# Altium project DMX Interface DB.PrjPcb (part 3 of 5)

## Sheet LED_low_side_control.SchDoc: LED Low Power
size B; SheetNumber: 6; SheetTotal: 14
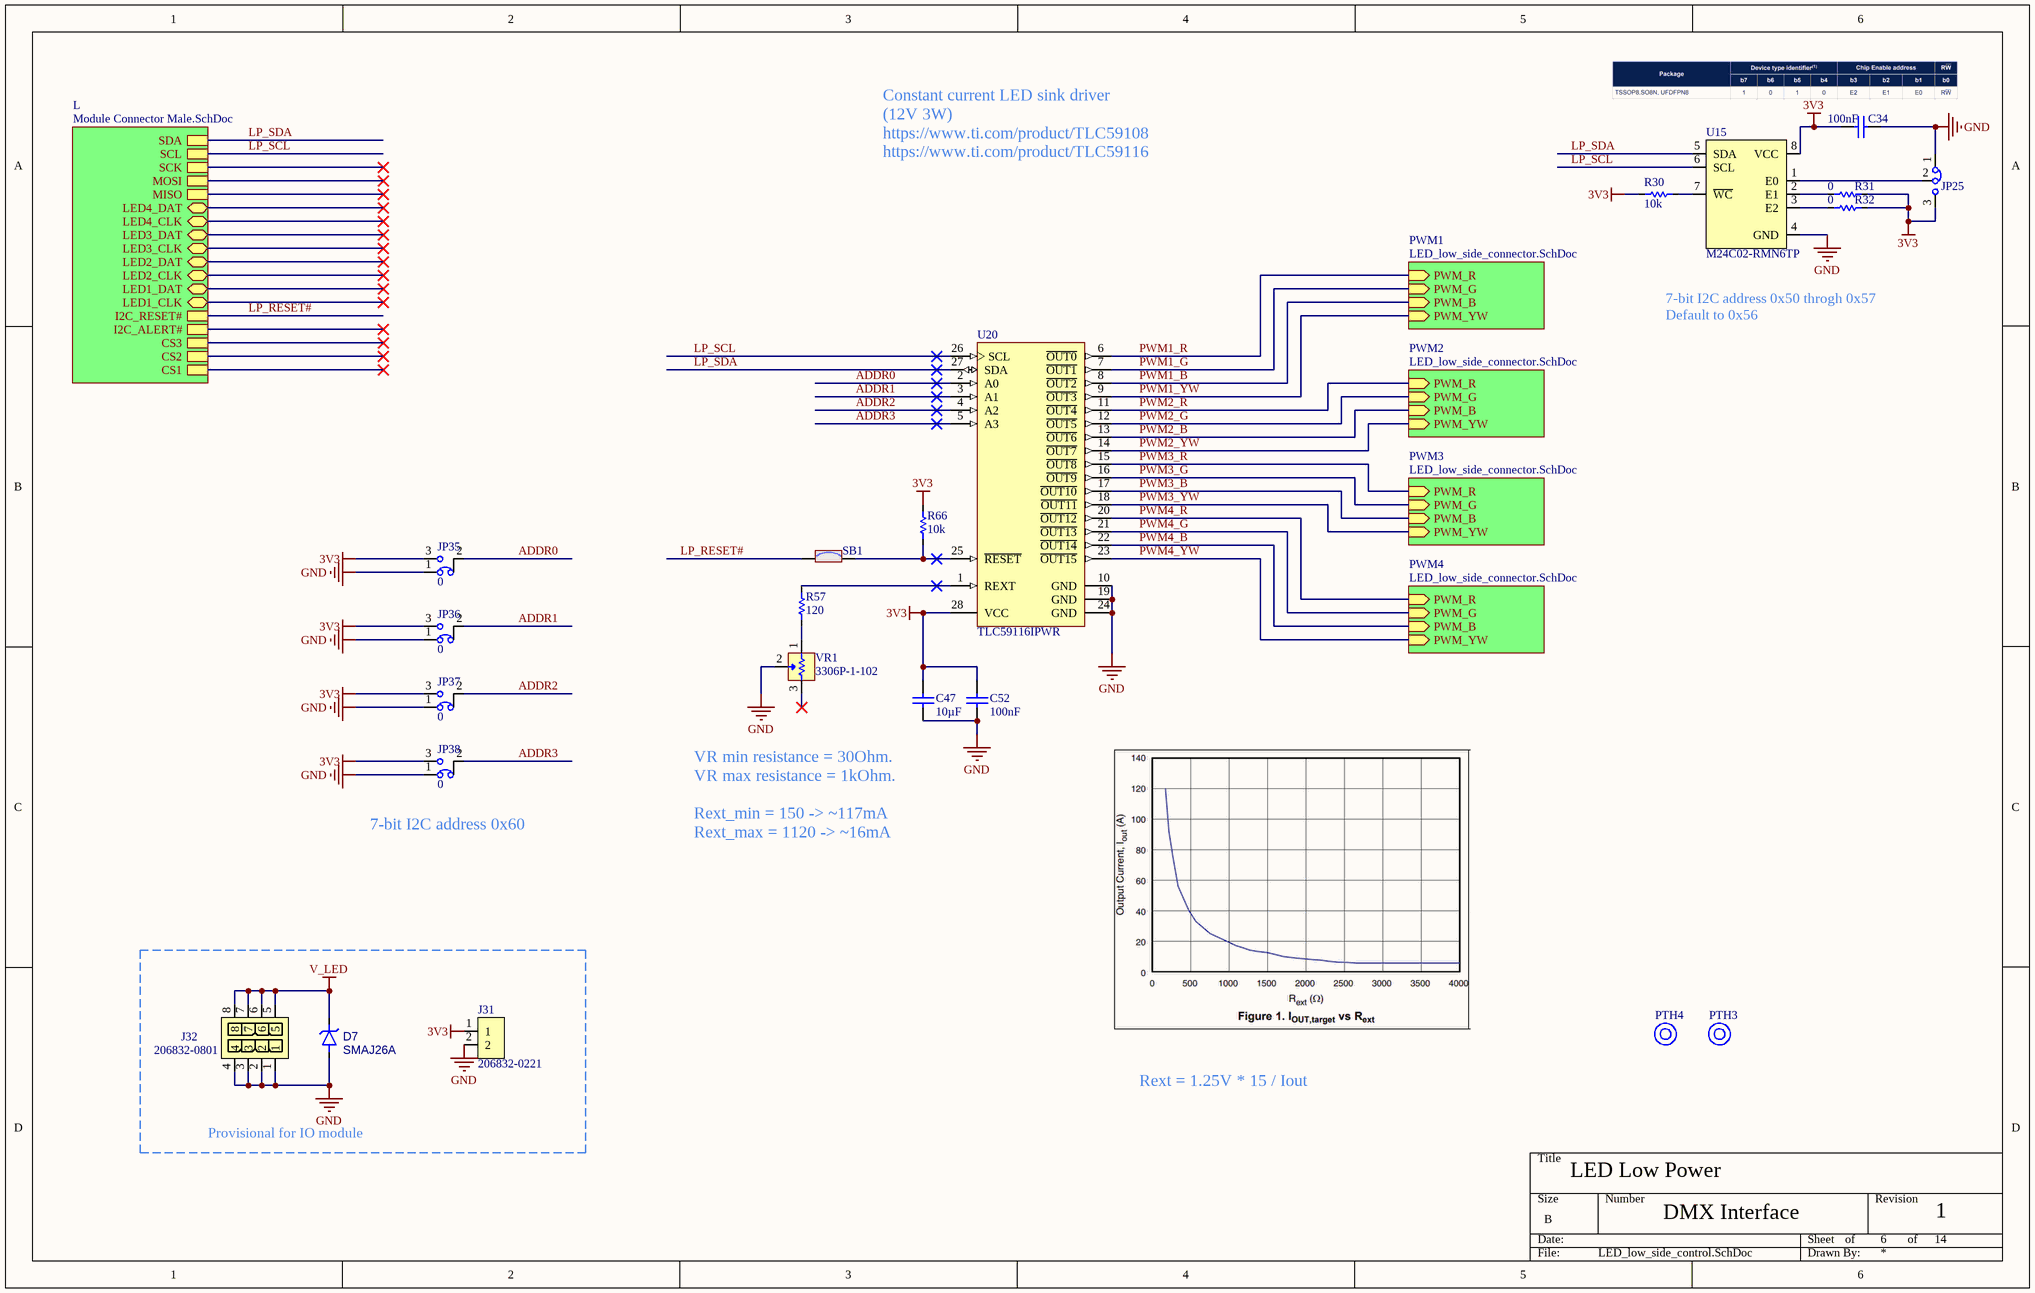
[diagram p4: LED_low_side_control.SchDoc]

### Parts
C34  value 100nF  [CAPC1608X10N_0603_MED]  (hidden comment: CC0603KRX7R0BB104)
C47  value 10µF  [CAPC2012X14N_0805_MED]  (hidden comment: GRM21BC81C106KA73L)
C52  value 100nF  [CAPC1608X10N_0603_MED]  (hidden comment: CC0603KRX7R0BB104)
D7  SMAJ26A  [FP-SMAJ-MFG]
J31  206832-0221  [206832-0221-Footprint-1]
J32  206832-0801  [206832-0801-Footprint-1]
JP25  Jumper 3 x 1 Bridge 1-2 Solder Bridge  [Jumper 3 Solder Bridge 1-2 0603]  (value not drawn)
JP35  value 0  [Jumper 3 Solder Bridge 1-2 0603]  (hidden comment: Jumper 3 x 1 Bridge 1-2 Solder Bridge)
JP36  value 0  [Jumper 3 Solder Bridge 1-2 0603]  (hidden comment: Jumper 3 x 1 Bridge 1-2 Solder Bridge)
JP37  value 0  [Jumper 3 Solder Bridge 1-2 0603]  (hidden comment: Jumper 3 x 1 Bridge 1-2 Solder Bridge)
JP38  value 0  [Jumper 3 Solder Bridge 1-2 0603]  (hidden comment: Jumper 3 x 1 Bridge 1-2 Solder Bridge)
PTH3  Mounting Hole NPTH  [Mounting Hole M3 No Washer NPTH]  (value not drawn)  (no BOM)
PTH4  Mounting Hole NPTH  [Mounting Hole M3 No Washer NPTH]  (value not drawn)  (no BOM)
R30  value 10k  [RESC1608X06N_0603_MED]  (hidden comment: RC0603FR-1010KL)
R31  value 0  [RESC1608X06N_0603_MED]  (hidden comment: RC0603FR-070RL)
R32  value 0  [RESC1608X06N_0603_MED]  (hidden comment: RC0603FR-070RL)
R57  value 120  [RESC1608X06N_0603_MED]  (hidden comment: RC0603FR-07120RL)
R66  value 10k  [RESC1608X06N_0603_MED]  (hidden comment: RC0603FR-1010KL)
SB1  SolderBridge0603_On  [SOLDER-BRIDGE_R0603-0R]  (value not drawn)
U15  M24C02-RMN6TP  [M24C02-RMN6TP-SO8N-IPC_B]
U20  TLC59116IPWR  [PW0028A_L]
VR1  3306P-1-102  [3306P-1-102-Footprint-1]

### Sub-sheets
L = Module Connector Male.SchDoc: SDA, SCL, SCK, MOSI, MISO, LED4_DAT (bidir), LED4_CLK (bidir), LED3_DAT (bidir), LED3_CLK (bidir), LED2_DAT (bidir), LED2_CLK (bidir), LED1_DAT (bidir), LED1_CLK (bidir), I2C_RESET#, I2C_ALERT#, CS3, CS2, CS1
PWM1 = LED_low_side_connector.SchDoc: PWM_B (in), PWM_G (in), PWM_R (in), PWM_YW (in)
PWM2 = LED_low_side_connector.SchDoc: PWM_B (in), PWM_G (in), PWM_R (in), PWM_YW (in)
PWM3 = LED_low_side_connector.SchDoc: PWM_B (in), PWM_G (in), PWM_R (in), PWM_YW (in)
PWM4 = LED_low_side_connector.SchDoc: PWM_B (in), PWM_G (in), PWM_R (in), PWM_YW (in)

### Nets
3V3: C34.1 C47.2 C52.1 J31.1 JP25.3 JP35.3 JP36.3 JP37.3 JP38.3 R30.2 R31.1 R32.1 R66.2 U15.8(VCC) U20.28(VCC)
GND: C34.2 C47.1 C52.2 D7.2(A) J31.2 J32.1 J32.2 J32.3 J32.4 JP25.1 JP35.1 JP36.1 JP37.1 JP38.1 U15.4(GND) U20.10(GND) U20.19(GND) U20.24(GND) VR1.2(Wipe)
V_LED: D7.1(K) J32.5 J32.6 J32.7 J32.8
ADDR0: JP35.2 U20.2(A0)
ADDR1: JP36.2 U20.3(A1)
ADDR2: JP37.2 U20.4(A2)
ADDR3: JP38.2 U20.5(A3)
LP_RESET#: SB1.1 ; sheet L/I2C_RESET#
LP_SCL: U15.6(SCL) U20.26(SCL) ; sheet L/SCL
LP_SDA: U15.5(SDA) U20.27(SDA) ; sheet L/SDA
PWM1_B: U20.8(~{OUT2}) ; sheet PWM1/PWM_B
PWM1_G: U20.7(~{OUT1}) ; sheet PWM1/PWM_G
PWM1_R: U20.6(~{OUT0}) ; sheet PWM1/PWM_R
PWM1_YW: U20.9(~{OUT3}) ; sheet PWM1/PWM_YW
PWM2_B: U20.13(~{OUT6}) ; sheet PWM2/PWM_B
PWM2_G: U20.12(~{OUT5}) ; sheet PWM2/PWM_G
PWM2_R: U20.11(~{OUT4}) ; sheet PWM2/PWM_R
PWM2_YW: U20.14(~{OUT7}) ; sheet PWM2/PWM_YW
PWM3_B: U20.17(~{OUT10}) ; sheet PWM3/PWM_B
PWM3_G: U20.16(~{OUT9}) ; sheet PWM3/PWM_G
PWM3_R: U20.15(~{OUT8}) ; sheet PWM3/PWM_R
PWM3_YW: U20.18(~{OUT11}) ; sheet PWM3/PWM_YW
PWM4_B: U20.22(~{OUT14}) ; sheet PWM4/PWM_B
PWM4_G: U20.21(~{OUT13}) ; sheet PWM4/PWM_G
PWM4_R: U20.20(~{OUT12}) ; sheet PWM4/PWM_R
PWM4_YW: U20.23(~{OUT15}) ; sheet PWM4/PWM_YW
NetJP25_2: JP25.2 U15.1(E0)
NetR30_1: R30.1 U15.7(~{WC})
NetR31_2: R31.2 U15.2(E1)
NetR32_2: R32.2 U15.3(E2)
NetR57_1: R57.1 VR1.1
NetR57_2: R57.2 U20.1(REXT)
NetR66_1: R66.1 SB1.2 U20.25(~{RESET})

Not connected (* = marked no-connect by the designer): VR1 3*

### Notes on the sheet
- Constant current LED sink driver
  (12V 3W)
  https://www.ti.com/product/TLC59108
  https://www.ti.com/product/TLC59116
- 7-bit I2C address 0x50 throgh 0x57
  Default to 0x56
- (near JP38) 7-bit I2C address 0x60
- VR min resistance = 30Ohm.
  VR max resistance = 1kOhm.
  Rext_min = 150 -> ~117mA
  Rext_max = 1120 -> ~16mA
- Rext = 1.25V * 15 / Iout
- Provisional for IO module
- of

### Library data of the parts
C34 C52 = CMP-001-00102-4: Ceramic Capacitor, Multilayer, Ceramic, 100V, 10% +Tol, 10% -Tol, X7R, 15% TC, 0.1uF, Surface Mount, 0603; Max Operating Temperature: 125°C; RoHS Compliant: Yes; Case/Package: 0603; Mounting Technology: Surface Mount; Capacitor Type: Ceramic; Pins: 2; Voltage Rating: 100V; Min Operating Temperature: -55°C; JLCPN: C113803
C47 = CMP-001-00084-4: Ceramic Capacitor, Multilayer, Ceramic, 10uF, 16V, 10%, X6S, 0805; RoHS Compliant: Yes; Max Operating Temperature: 105°C; Case/Package: 0805; Pins: 2; Tolerance: 10%; Min Operating Temperature: -55°C; Mounting Technology: Surface Mount; Voltage Rating: 16V; Capacitor Type: Ceramic; JLCPN: C162413
D7 = CMP-004-00046-2: Trans Voltage Suppressor Diode, 400W, 26V V(RWM), Unidirectional, 1 Element, Silicon, DO-214AC; Min Operating Temperature: -65°C; RoHS Compliant: Yes; Max Operating Temperature: 150°C; Pins: 2; JLCPN: C148225
J31 = CMP-002-00210-4: Micro-Fit+, Vertial Header, 2 Position 3mm pitch; Max Current Rating: 12.5A; Gender: Male; Pins: 2; Connector Type: Micro-Fit+
J32 = CMP-002-00208-6: Micro-Fit+, Vertical Header, 8 pin; Max Current Rating: 12.5A; Connector Type: Micro-Fit+; Mounting Technology: Through Hole; Pins: 8
JP25 = CMP-009-00341-2: 0603 Solder Bridge Jumper Surface Mount; Tolerance: 1%; Voltage Rating: 75V; Value: 0; Pins: 2; Case/Package: 0603; RoHS Compliant: Yes; Max Operating Temperature: 155°C; Min Operating Temperature: -55°C; Mounting Technology: Surface Mount
JP35-JP38 = CMP-009-00341-2: 0603 Solder Bridge Jumper Surface Mount; Tolerance: 1%; Voltage Rating: 75V; Pins: 2; Case/Package: 0603; Min Operating Temperature: -55°C; Mounting Technology: Surface Mount; Max Operating Temperature: 155°C; RoHS Compliant: Yes
PTH3 PTH4 = CMP-00028-00043-3
R30 R66 = CMP-009-00306-2: Fixed Resistor, Metal Glaze/thick Film, 0.1W, 10000ohm, 75V, 1% +/-Tol, 100ppm/Cel, Surface Mount, 0603; Power: 100mW; Voltage Rating: 50V; Max Operating Temperature: 155°C; Case/Package: 0603; Mounting Technology: Surface Mount; Tolerance: 1%; Min Operating Temperature: -55°C; RoHS Compliant: Yes; Pins: 2; JLCPN: C98220
R31 R32 = CMP-009-00204-3: RC Series 0603 0.1 W 0 Ohm Jumper Surface Mount Thick Film Chip Resistor; Power: 100mW; Voltage Rating: 75V; Tolerance: 1%; Mounting Technology: Surface Mount; Pins: 2; Case/Package: 0603; Max Operating Temperature: 155°C; Min Operating Temperature: -55°C; RoHS Compliant: Yes; JLCPN: C100044
R57 = CMP-009-00303-2: Res General Purpose Thick Film 0603 120 Ohm 1% 1/10W ±100ppm/°C Molded SMD Paper T/R; Power: 100mW; Voltage Rating: 50V; Min Operating Temperature: -55°C; Tolerance: 1%; Max Operating Temperature: 155°C; Case/Package: 0603; Pins: 2; Mounting Technology: Surface Mount; RoHS Compliant: Yes; JLCPN: C114640
SB1 = CMP-128-000020-6: Solder Bridge ON; Internal_Part_Number: MCD-00071; Manufacturer: YAGEO; Part_Type: Mechanical; Manufacturer_Part_Number: RC0603JR-070RL; Provided_By: SUBCO; ECCN_EU: n/a; Package: SB0603; ComponentLink1Description: Datasheet; Source: MB1404.SCHLIB; Status: Released; Design Item ID: SolderBridge0603_On; ComponentLink1URL: http://tunmcdsvn.tun.st.com/Component_Datasheet_Library/Trunk/Resistors/Yageo_Resistor_RC0603-series; ECCN_US: n/a; JLCPN: C100044
U15 = CMP-019-00078-2: M24C02 Series 2 Kb (256 x 8) 1.8 V SMT Serial I²C Bus EEPROM - SOIC-8; Max Supply Voltage: 5.5V; Min Supply Voltage: 1.8V; Frequency: 400kHz; Memory Size: 256B; Case/Package: SOIC; Pins: 8; Clock Frequency: 400kHz; Min Operating Temperature: -40°C; Memory Format: EEPROM; Max Operating Temperature: 85°C; Mounting Technology: Surface Mount; JLCPN: C83836
U20 = CMP-00024-00008-2: LED Driver, 16-Segment, PDSO28; Nominal Supply Voltage: 3.3V; Case/Package: TSSOP; Min Operating Temperature: -40°C; Max Operating Temperature: 85°C; Pins: 28; RoHS Compliant: Yes; JLCPN: C131194
VR1 = CMP-00028-00042-1: Trimmer, Cermet, 0.2W, 1000ohm, 100V, 25% +/-Tol, 250ppm/Cel, 1 Turn(s); Pins: 3; Mounting Technology: Through Hole; Max Operating Temperature: 100°C; RoHS Compliant: Yes; Min Operating Temperature: -25°C

## Sheet LED_low_side_connector.SchDoc: LED Low Power Connector
size B; SheetNumber: 7; SheetTotal: 14
Used 4 times, as channels Low Power LED Module/PWM1, Low Power LED Module/PWM2, Low Power LED Module/PWM3, Low Power LED Module/PWM4. Parts and nets are listed once, with the designators drawn on the sheet.
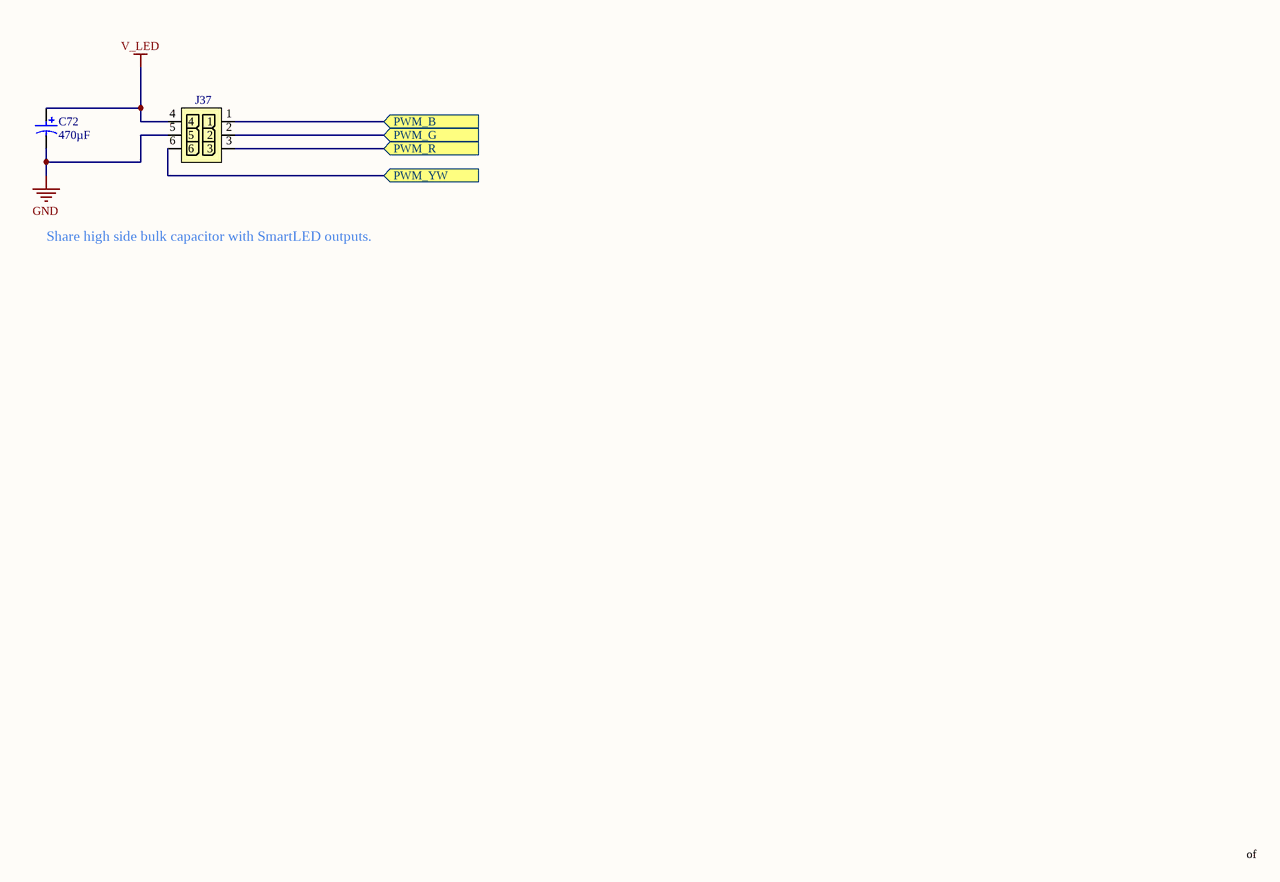
[diagram p5: LED_low_side_connector.SchDoc]

### Parts
C72  value 470µF  [CAP_POL_DIAM10_H22_SPACING5]  (hidden comment: REH1020471M050K)
J37  212528-0600  [212528-0600-Footprint-1]  (value not drawn)

### Ports
PWM_B (in), PWM_G (in), PWM_R (in), PWM_YW (in)

### Nets
GND: C72.2 J37.5
V_LED: C72.1 J37.4
PWM_B: J37.1 ; port PWM_B
PWM_G: J37.2 ; port PWM_G
PWM_R: J37.3 ; port PWM_R
PWM_YW: J37.6 ; port PWM_YW

### Channels
Low Power LED Module/PWM1: designators end in _PWM1; ports PWM_B=PWM1_B PWM_G=PWM1_G PWM_R=PWM1_R PWM_YW=PWM1_YW
Low Power LED Module/PWM2: designators end in _PWM2; ports PWM_B=PWM2_B PWM_G=PWM2_G PWM_R=PWM2_R PWM_YW=PWM2_YW
Low Power LED Module/PWM3: designators end in _PWM3; ports PWM_B=PWM3_B PWM_G=PWM3_G PWM_R=PWM3_R PWM_YW=PWM3_YW
Low Power LED Module/PWM4: designators end in _PWM4; ports PWM_B=PWM4_B PWM_G=PWM4_G PWM_R=PWM4_R PWM_YW=PWM4_YW

### Notes on the sheet
- Share high side bulk capacitor with SmartLED outputs.
- of

### Library data of the parts
C72 = CMP-001-00166-1: CAP ALUM 470UF 20% 50V RADIAL TH; Capacitor Type: Aluminium; RoHS Compliant: Yes; Case/Package: Radial; Tolerance: 20%; Voltage Rating: 50V; Min Operating Temperature: 125°C; Max Operating Temperature: -40°C; Mounting Technology: Through Hole; Pins: 2
J37 = CMP-002-00218-3: Connector, Micro-Fit+ Right Angle 6ckt Header - Tin; Gender: Male; Max Current Rating: 12.5A; Mounting Technology: Through Hole; Pins: 6; Connector Type: Micro-Fit+

## Sheet Module Connector Male.SchDoc: Module Connector Male
size B; SheetNumber: 5; SheetTotal: 14
Used 3 times, as channels Low Power LED Module/L, SL/S, HP_LED/H. Parts and nets are listed once, with the designators drawn on the sheet.
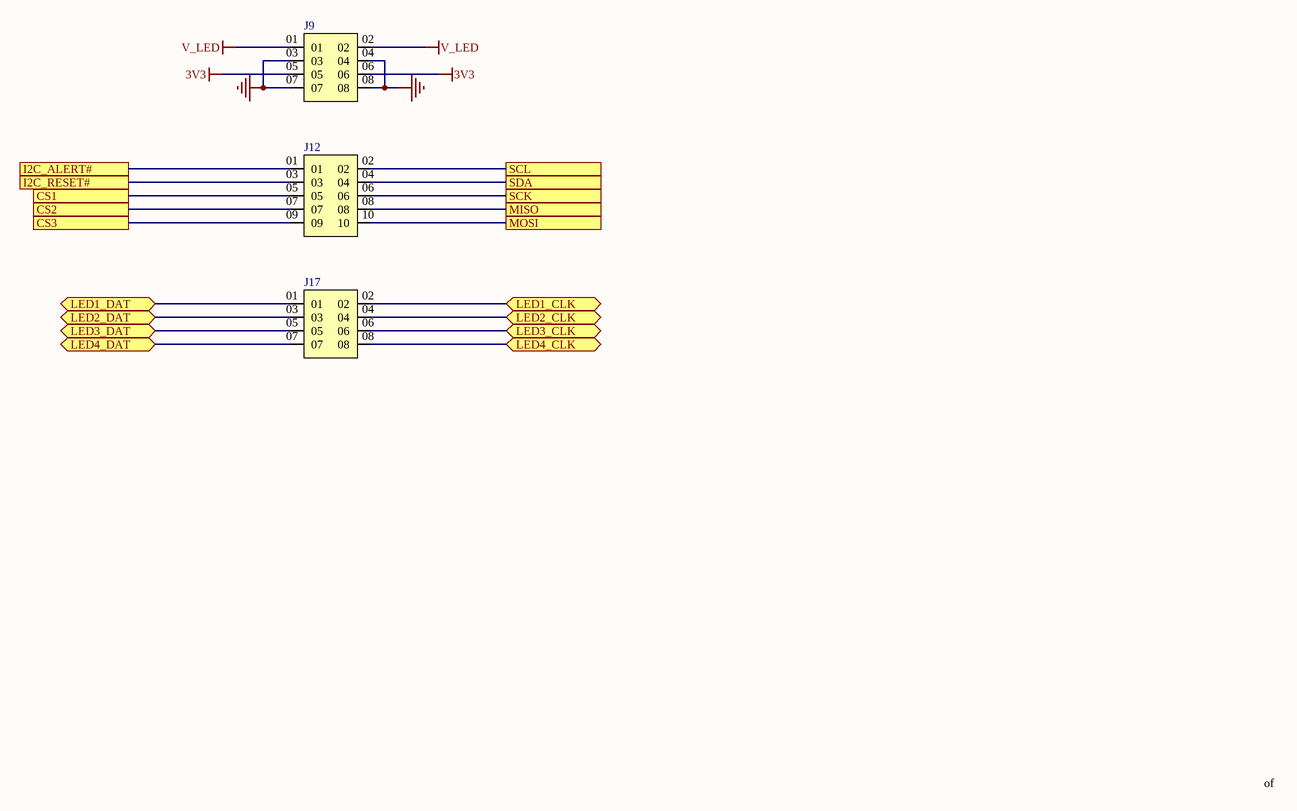
[diagram p6: Module Connector Male.SchDoc]

### Parts
J9  Header 4x2 0.1" RA  [Header 4x2 0.1" RA]  (value not drawn)
J12  Header 5x2 0.1" RA  [Header 5x2 0.1" RA]  (value not drawn)
J17  Header 4x2 0.1" RA  [Header 4x2 0.1" RA]  (value not drawn)

### Ports
CS1, CS2, CS3, I2C_ALERT#, I2C_RESET#, LED1_CLK (bidir), LED1_DAT (bidir), LED2_CLK (bidir), LED2_DAT (bidir), LED3_CLK (bidir), LED3_DAT (bidir), LED4_CLK (bidir), LED4_DAT (bidir), MISO, MOSI, SCK, SCL, SDA

### Nets
3V3: J9.05 J9.06
GND: J9.03 J9.04 J9.07 J9.08
V_LED: J9.01 J9.02
CS1: J12.05 ; port CS1
CS2: J12.07 ; port CS2
CS3: J12.09 ; port CS3
I2C_ALERT#: J12.01 ; port I2C_ALERT#
I2C_RESET#: J12.03 ; port I2C_RESET#
LED1_CLK: J17.02 ; port LED1_CLK
LED1_DAT: J17.01 ; port LED1_DAT
LED2_CLK: J17.04 ; port LED2_CLK
LED2_DAT: J17.03 ; port LED2_DAT
LED3_CLK: J17.06 ; port LED3_CLK
LED3_DAT: J17.05 ; port LED3_DAT
LED4_CLK: J17.08 ; port LED4_CLK
LED4_DAT: J17.07 ; port LED4_DAT
MISO: J12.08 ; port MISO
MOSI: J12.10 ; port MOSI
SCK: J12.06 ; port SCK
SCL: J12.02 ; port SCL
SDA: J12.04 ; port SDA

### Channels
Low Power LED Module/L: designators end in _L; ports CS1=NetJ12_L_05 CS2=NetJ12_L_07 CS3=NetJ12_L_09 I2C_ALERT#=NetJ12_L_01 I2C_RESET#=LP_RESET# LED1_CLK=NetJ17_L_02 LED1_DAT=NetJ17_L_01 LED2_CLK=NetJ17_L_04 LED2_DAT=NetJ17_L_03 LED3_CLK=NetJ17_L_06 LED3_DAT=NetJ17_L_05 LED4_CLK=NetJ17_L_08 LED4_DAT=NetJ17_L_07 MISO=NetJ12_L_08 MOSI=NetJ12_L_10 SCK=NetJ12_L_06 SCL=LP_SCL SDA=LP_SDA
SL/S: designators end in _S; ports CS1=NetJ12_S_05 CS2=NetJ12_S_07 CS3=NetJ12_S_09 I2C_ALERT#=NetJ12_S_01 I2C_RESET#=NetJ12_S_03 LED1_CLK=LED1_CLK LED1_DAT=LED1_DAT LED2_CLK=LED2_CLK LED2_DAT=LED2_DAT LED3_CLK=LED3_CLK LED3_DAT=LED3_DAT LED4_CLK=LED4_CLK LED4_DAT=LED4_DAT MISO=NetJ12_S_08 MOSI=NetJ12_S_10 SCK=NetJ12_S_06 SCL=SmartLED_SCL SDA=SmartLED_SDA
HP_LED/H: designators end in _H; ports CS1=NetJ12_H_05 CS2=NetJ12_H_07 CS3=NetJ12_H_09 I2C_ALERT#=NetJ12_H_01 I2C_RESET#=NetJ12_H_03 LED1_CLK=NetJ17_H_02 LED1_DAT=NetJ17_H_01 LED2_CLK=NetJ17_H_04 LED2_DAT=PWM2 LED3_CLK=NetJ17_H_06 LED3_DAT=PWM3 LED4_CLK=NetJ17_H_08 LED4_DAT=PWM4 MISO=NetJ12_H_08 MOSI=NetJ12_H_10 SCK=NetJ12_H_06 SCL=HP_SCL SDA=HP_SDA

### Notes on the sheet
- of

### Library data of the parts
J9 J17 = CMP-002-00226-4: Board Connector, 8 Contact(s), 2 Row(s), Female, Right Angle, 0.1 inch Pitch; Gender: Male; Max Current Rating: 3A; Connector Type: BOARD CONNECTOR; RoHS Compliant: Yes; Max Operating Temperature: 105°C; Min Operating Temperature: -40°C; Mounting Technology: Board; Pins: 8
J12 = CMP-002-00230-4: Board Connector, 10 Contact(s), 2 Row(s), Female, Right Angle, 0.1 inch Pitch; Gender: Male; Max Current Rating: 3A; Min Operating Temperature: -40°C; Pins: 10; Mounting Technology: Board; Max Operating Temperature: 125°C; Connector Type: BOARD CONNECTOR; RoHS Compliant: Yes

## Sheet Microcontroller.SchDoc: Microcontroller
size B; SheetNumber: 2; SheetTotal: 14
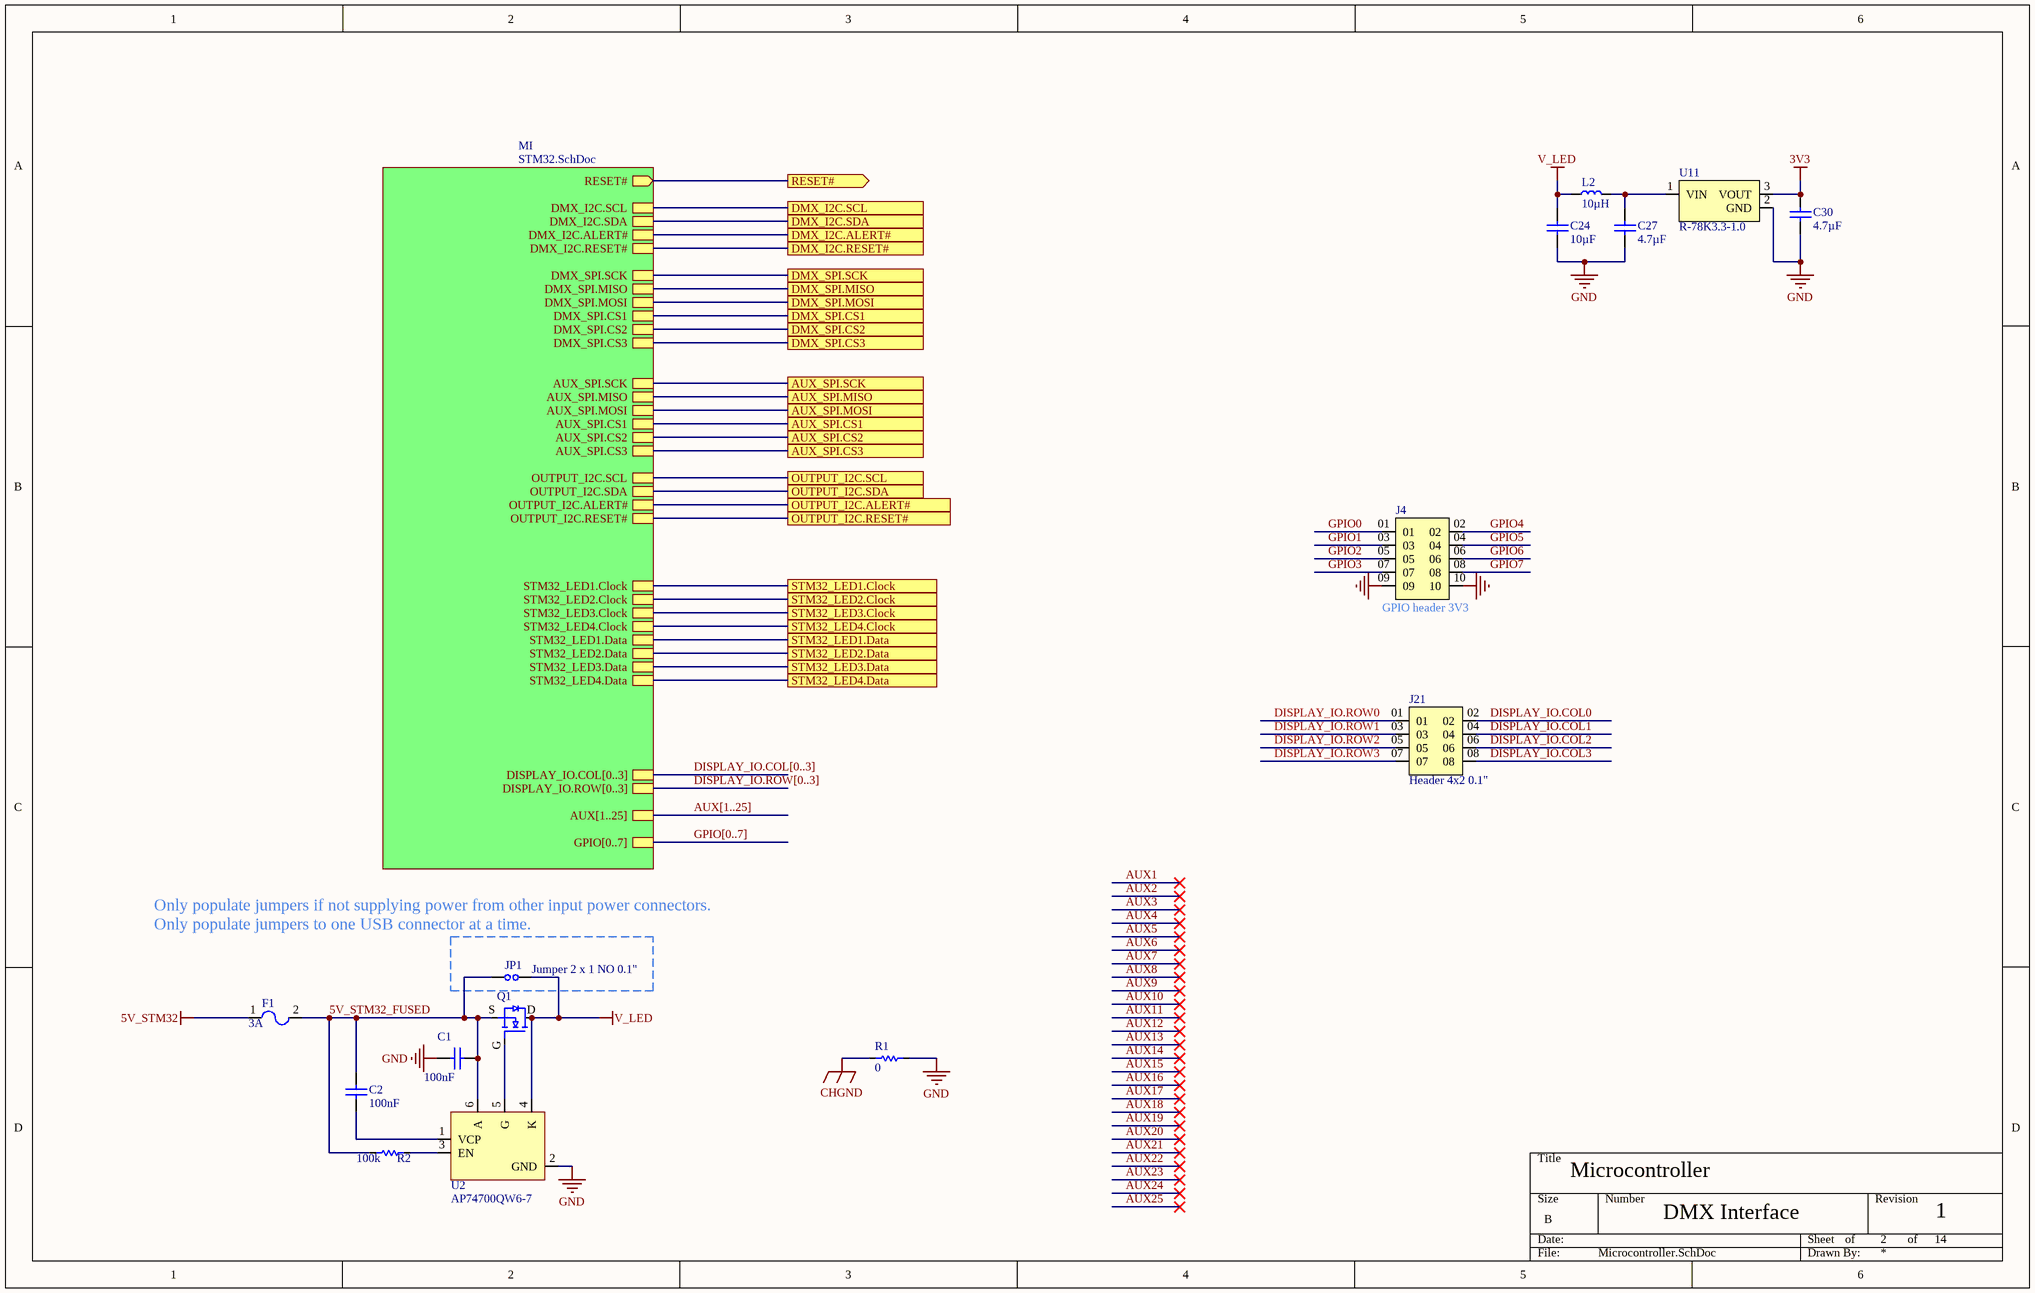
[diagram p7: Microcontroller.SchDoc]

### Parts
C1  value 100nF  [CAPC1608X10N_0603_MED]  (hidden comment: CC0603KRX7R0BB104)
C2  value 100nF  [CAPC1608X10N_0603_MED]  (hidden comment: CC0603KRX7R0BB104)
C24  value 10µF  [CAPC2012X14N_0805_MED]  (hidden comment: GRM21BR61H106KE43L)
C27  value 4.7µF  [CAPC2012X14N_0805_MED]  (hidden comment: GRM21BR61H475KE51L)
C30  value 4.7µF  [CAPC2012X14N_0805_MED]  (hidden comment: GRM21BR61H475KE51L)
F1  Current Rating: 3A  [FUSE4532X1.55N_1812MED]  (hidden comment: 0ZCG0300FF2B)
J4  Header 5x2 0.1"  [HEADER 5x2 0.1 Through hole]  (value not drawn)
J21  Header 4x2 0.1"  [Header 4x2 0.1"]
JP1  Jumper 2 x 1 NO 0.1"  [FP-M20-9990245-MFG]
L2  value 10µH  [FP-SRN5040-MFG]  (hidden comment: SRN5040-100M)
Q1  BUK9880-55A/CUX  [SOT230P700X180-4N]  (value not drawn)
R1  value 0  [RESC1608X06N_0603_MED]  (hidden comment: RC0603FR-070RL)
R2  value 100k  [RESC1608X06N_0603_MED]  (hidden comment: RC0603DR-07100KL)
U2  AP74700QW6-7  [SOT95P285X130-6N]
U11  R-78K3.3-1.0  [R-78K3.3-1.0-Footprint-1]

### Sub-sheets
MI = STM32.SchDoc: RESET# (out), AUX[1..25], GPIO[0..7], DISPLAY_IO.COL[0..3], DISPLAY_IO.ROW[0..3], DMX_I2C.SCL, DMX_I2C.SDA, DMX_I2C.ALERT#, DMX_I2C.RESET#, DMX_SPI.SCK, DMX_SPI.MISO, DMX_SPI.MOSI, DMX_SPI.CS1, DMX_SPI.CS2, DMX_SPI.CS3, AUX_SPI.SCK, AUX_SPI.MISO, AUX_SPI.MOSI, AUX_SPI.CS1, AUX_SPI.CS2, AUX_SPI.CS3, OUTPUT_I2C.SCL, OUTPUT_I2C.SDA, OUTPUT_I2C.ALERT#, OUTPUT_I2C.RESET#, STM32_LED1.Clock, STM32_LED2.Clock, STM32_LED3.Clock, STM32_LED4.Clock, STM32_LED1.Data, STM32_LED2.Data, STM32_LED3.Data, STM32_LED4.Data

### Ports
AUX_SPI.CS1, AUX_SPI.CS2, AUX_SPI.CS3, AUX_SPI.MISO, AUX_SPI.MOSI, AUX_SPI.SCK, DMX_I2C.ALERT#, DMX_I2C.RESET#, DMX_I2C.SCL, DMX_I2C.SDA, DMX_SPI.CS1, DMX_SPI.CS2, DMX_SPI.CS3, DMX_SPI.MISO, DMX_SPI.MOSI, DMX_SPI.SCK, OUTPUT_I2C.ALERT#, OUTPUT_I2C.RESET#, OUTPUT_I2C.SCL, OUTPUT_I2C.SDA, RESET# (out), STM32_LED1.Clock, STM32_LED1.Data, STM32_LED2.Clock, STM32_LED2.Data, STM32_LED3.Clock, STM32_LED3.Data, STM32_LED4.Clock, STM32_LED4.Data

### Nets
3V3: C30.2 U11.3(VOUT)
5V_STM32: F1.1
CHGND: R1.1
GND: C1.2 C24.1 C27.1 C30.1 J4.09 J4.10 R1.2 U2.2(GND) U11.2(GND)
V_LED: C24.2 JP1.2 L2.1 Q1.D U2.4(K)
5V_STM32_FUSED: C1.1 C2.2 F1.2 JP1.1 Q1.S R2.1 U2.6(A)
AUX_SPI.CS1: port AUX_SPI.CS1, sheet MI/AUX_SPI.CS1
AUX_SPI.CS2: port AUX_SPI.CS2, sheet MI/AUX_SPI.CS2
AUX_SPI.CS3: port AUX_SPI.CS3, sheet MI/AUX_SPI.CS3
AUX_SPI.MISO: port AUX_SPI.MISO, sheet MI/AUX_SPI.MISO
AUX_SPI.MOSI: port AUX_SPI.MOSI, sheet MI/AUX_SPI.MOSI
AUX_SPI.SCK: port AUX_SPI.SCK, sheet MI/AUX_SPI.SCK
DISPLAY_IO.COL0: J21.02
DISPLAY_IO.COL1: J21.04
DISPLAY_IO.COL2: J21.06
DISPLAY_IO.COL3: J21.08
DISPLAY_IO.ROW0: J21.01
DISPLAY_IO.ROW1: J21.03
DISPLAY_IO.ROW2: J21.05
DISPLAY_IO.ROW3: J21.07
DMX_I2C.ALERT#: port DMX_I2C.ALERT#, sheet MI/DMX_I2C.ALERT#
DMX_I2C.RESET#: port DMX_I2C.RESET#, sheet MI/DMX_I2C.RESET#
DMX_I2C.SCL: port DMX_I2C.SCL, sheet MI/DMX_I2C.SCL
DMX_I2C.SDA: port DMX_I2C.SDA, sheet MI/DMX_I2C.SDA
DMX_SPI.CS1: port DMX_SPI.CS1, sheet MI/DMX_SPI.CS1
DMX_SPI.CS2: port DMX_SPI.CS2, sheet MI/DMX_SPI.CS2
DMX_SPI.CS3: port DMX_SPI.CS3, sheet MI/DMX_SPI.CS3
DMX_SPI.MISO: port DMX_SPI.MISO, sheet MI/DMX_SPI.MISO
DMX_SPI.MOSI: port DMX_SPI.MOSI, sheet MI/DMX_SPI.MOSI
DMX_SPI.SCK: port DMX_SPI.SCK, sheet MI/DMX_SPI.SCK
GPIO0: J4.01
GPIO1: J4.03
GPIO2: J4.05
GPIO3: J4.07
GPIO4: J4.02
GPIO5: J4.04
GPIO6: J4.06
GPIO7: J4.08
OUTPUT_I2C.ALERT#: port OUTPUT_I2C.ALERT#, sheet MI/OUTPUT_I2C.ALERT#
OUTPUT_I2C.RESET#: port OUTPUT_I2C.RESET#, sheet MI/OUTPUT_I2C.RESET#
OUTPUT_I2C.SCL: port OUTPUT_I2C.SCL, sheet MI/OUTPUT_I2C.SCL
OUTPUT_I2C.SDA: port OUTPUT_I2C.SDA, sheet MI/OUTPUT_I2C.SDA
RP2040_RST#: port RESET#, sheet MI/RESET#
STM32_LED1.Clock: port STM32_LED1.Clock, sheet MI/STM32_LED1.Clock
STM32_LED1.Data: port STM32_LED1.Data, sheet MI/STM32_LED1.Data
STM32_LED2.Clock: port STM32_LED2.Clock, sheet MI/STM32_LED2.Clock
STM32_LED2.Data: port STM32_LED2.Data, sheet MI/STM32_LED2.Data
STM32_LED3.Clock: port STM32_LED3.Clock, sheet MI/STM32_LED3.Clock
STM32_LED3.Data: port STM32_LED3.Data, sheet MI/STM32_LED3.Data
STM32_LED4.Clock: port STM32_LED4.Clock, sheet MI/STM32_LED4.Clock
STM32_LED4.Data: port STM32_LED4.Data, sheet MI/STM32_LED4.Data
NetC2_1: C2.1 U2.1(VCP)
NetC27_2: C27.2 L2.2 U11.1(VIN)
NetQ1_G: Q1.G U2.5(G)
NetR2_2: R2.2 U2.3(EN)

### Buses and harness runs
bus AUX[1..25] = sheet MI/AUX[1..25]
bus DISPLAY_IO.COL[0..3] = sheet MI/DISPLAY_IO.COL[0..3]
bus DISPLAY_IO.ROW[0..3] = sheet MI/DISPLAY_IO.ROW[0..3]
bus GPIO[0..7] = sheet MI/GPIO[0..7]

### Notes on the sheet
- (near J4) GPIO header 3V3
- (near JP1) Only populate jumpers if not supplying power from other input power connectors.
  Only populate jumpers to one USB connector at a time.
- of

### Library data of the parts
C1 C2 = CMP-001-00102-4: as C34 on sheet LED_low_side_control; Max Operating Temperature: 125°C; RoHS Compliant: Yes; Case/Package: 0603; Mounting Technology: Surface Mount; Capacitor Type: Ceramic; Pins: 2; Voltage Rating: 100V; Min Operating Temperature: -55°C; JLCPN: C113803
C24 = CMP-001-00169-2: Ceramic Capacitor, Multilayer, Ceramic, 10uF, 50V, 10%, X6S, 0805; Mounting Technology: Surface Mount; Case/Package: 0805; Tolerance: 10%; RoHS Compliant: Yes; Capacitor Type: Ceramic; Max Operating Temperature: 85°C; Min Operating Temperature: -55°C; Pins: 2; Voltage Rating: 50V; JLCPN: C440198
C27 C30 = CMP-001-00165-2: Ceramic Capacitor, Multilayer, Ceramic, 50V, 10% +Tol, 10% -Tol, X5R, 15% TC, 4.7uF, Surface Mount, 0805; Min Operating Temperature: -55°C; Max Operating Temperature: 85°C; Voltage Rating: 50V; Mounting Technology: Surface Mount; Tolerance: 10%; Case/Package: 0805; RoHS Compliant: Yes; Capacitor Type: Ceramic; Pins: 2; JLCPN: C162420
F1 = CMP-005-00018-1: PTC Resettable Fuse, 6V, 3A Surface Mount; Max Operating Temperature: 85°C; Case/Package: 1812; Pins: 2; Mounting Technology: SMT; Min Operating Temperature: -40°C; RoHS Compliant: Yes
J4 = CMP-002-00228-3: Board Connector Tall, 10 Contact(s), 2 Row(s), Male, Straight, 0.1 inch Pitch; Max Current Rating: 3A; Mounting Technology: Board; RoHS Compliant: Yes; Gender: Male; Pins: 10; Connector Type: Header
J21 = CMP-002-00227-2: Board Connector, 8 Contact(s), 2 Row(s), Female, 0.1 inch Pitch; Gender: Male; Max Current Rating: 3A; Pins: 8; Max Operating Temperature: 105°C; Connector Type: BOARD CONNECTOR; RoHS Compliant: Yes; Min Operating Temperature: -40°C; Mounting Technology: Board
JP1 = CMP-002-00086-5: Connector Type: BOARD CONNECTOR; Pins: 2; Max Operating Temperature: 105°C; RoHS Compliant: Yes; Mounting Technology: Through Hole; Min Operating Temperature: -40°C
L2 = CMP-006-00030-2: General Purpose Inductor, 10uH, 20%, 1 Element, Ferrite-Core, SMD, 2020; Self Resonant Frequency: 17MHz; Max Current Rating: 2.1A; Min Operating Temperature: -40°C; Pins: 2; Mounting Technology: SMT; Max Operating Temperature: 125°C; Tolerance: 20%; RoHS Compliant: Yes; JLCPN: C1329529
Q1 = CMP-013-00051-4: BUK9880 Series 55 V 7A 73 mOhm N-Channel TrenchMOS Logic Level FET - SC-73; Vgs (Max): 15V; Pins: 4; Max Operating Temperature: 150°C; Case/Package: SOT; Vgs(th) (Max) @ Id: v; Min Operating Temperature: -55°C
R1 = CMP-009-00204-3: RC Series 0603 0.1 W 0 Ohm Jumper Surface Mount Thick Film Chip Resistor; Tolerance: 1%; Voltage Rating: 75V; Power: 100mW; Min Operating Temperature: -55°C; Pins: 2; Case/Package: 0603; Max Operating Temperature: 155°C; RoHS Compliant: Yes; Mounting Technology: Surface Mount; JLCPN: C100044
R2 = CMP-009-00328-2: Fixed Resistor, Metal Glaze/thick Film, 0.1W, 100000ohm, 75V, 0.5% +/-Tol, 100ppm/Cel, Surface Mount, 0603; Power: 100mW; Voltage Rating: 50V; RoHS Compliant: Yes; Max Operating Temperature: 155°C; JLCPN: C163504; Case/Package: 0603; Min Operating Temperature: -55°C; Pins: 2; Mounting Technology: Surface Mount; Tolerance: 0.5%
U2 = CMP-004-00052-1: ORController N-Channel Single Automotive AEC-Q100 6-Pin SOT-26 T/R; Min Operating Temperature: -40°C; Max Operating Temperature: 125°C
U11 = CMP-019-00075-1: R-78K-1.0 Series Single Output 3.3 V 1 A Non Isolated DC/DC Converter - SIP-3; Output Current: 1A; Min Supply Voltage: 4.75V; Output Voltage: 3.3V; Max Supply Voltage: 36V; Pins: 3

## Sheet STM32.SchDoc: STM32H563ZIT6
size B; SheetNumber: 3; SheetTotal: 14
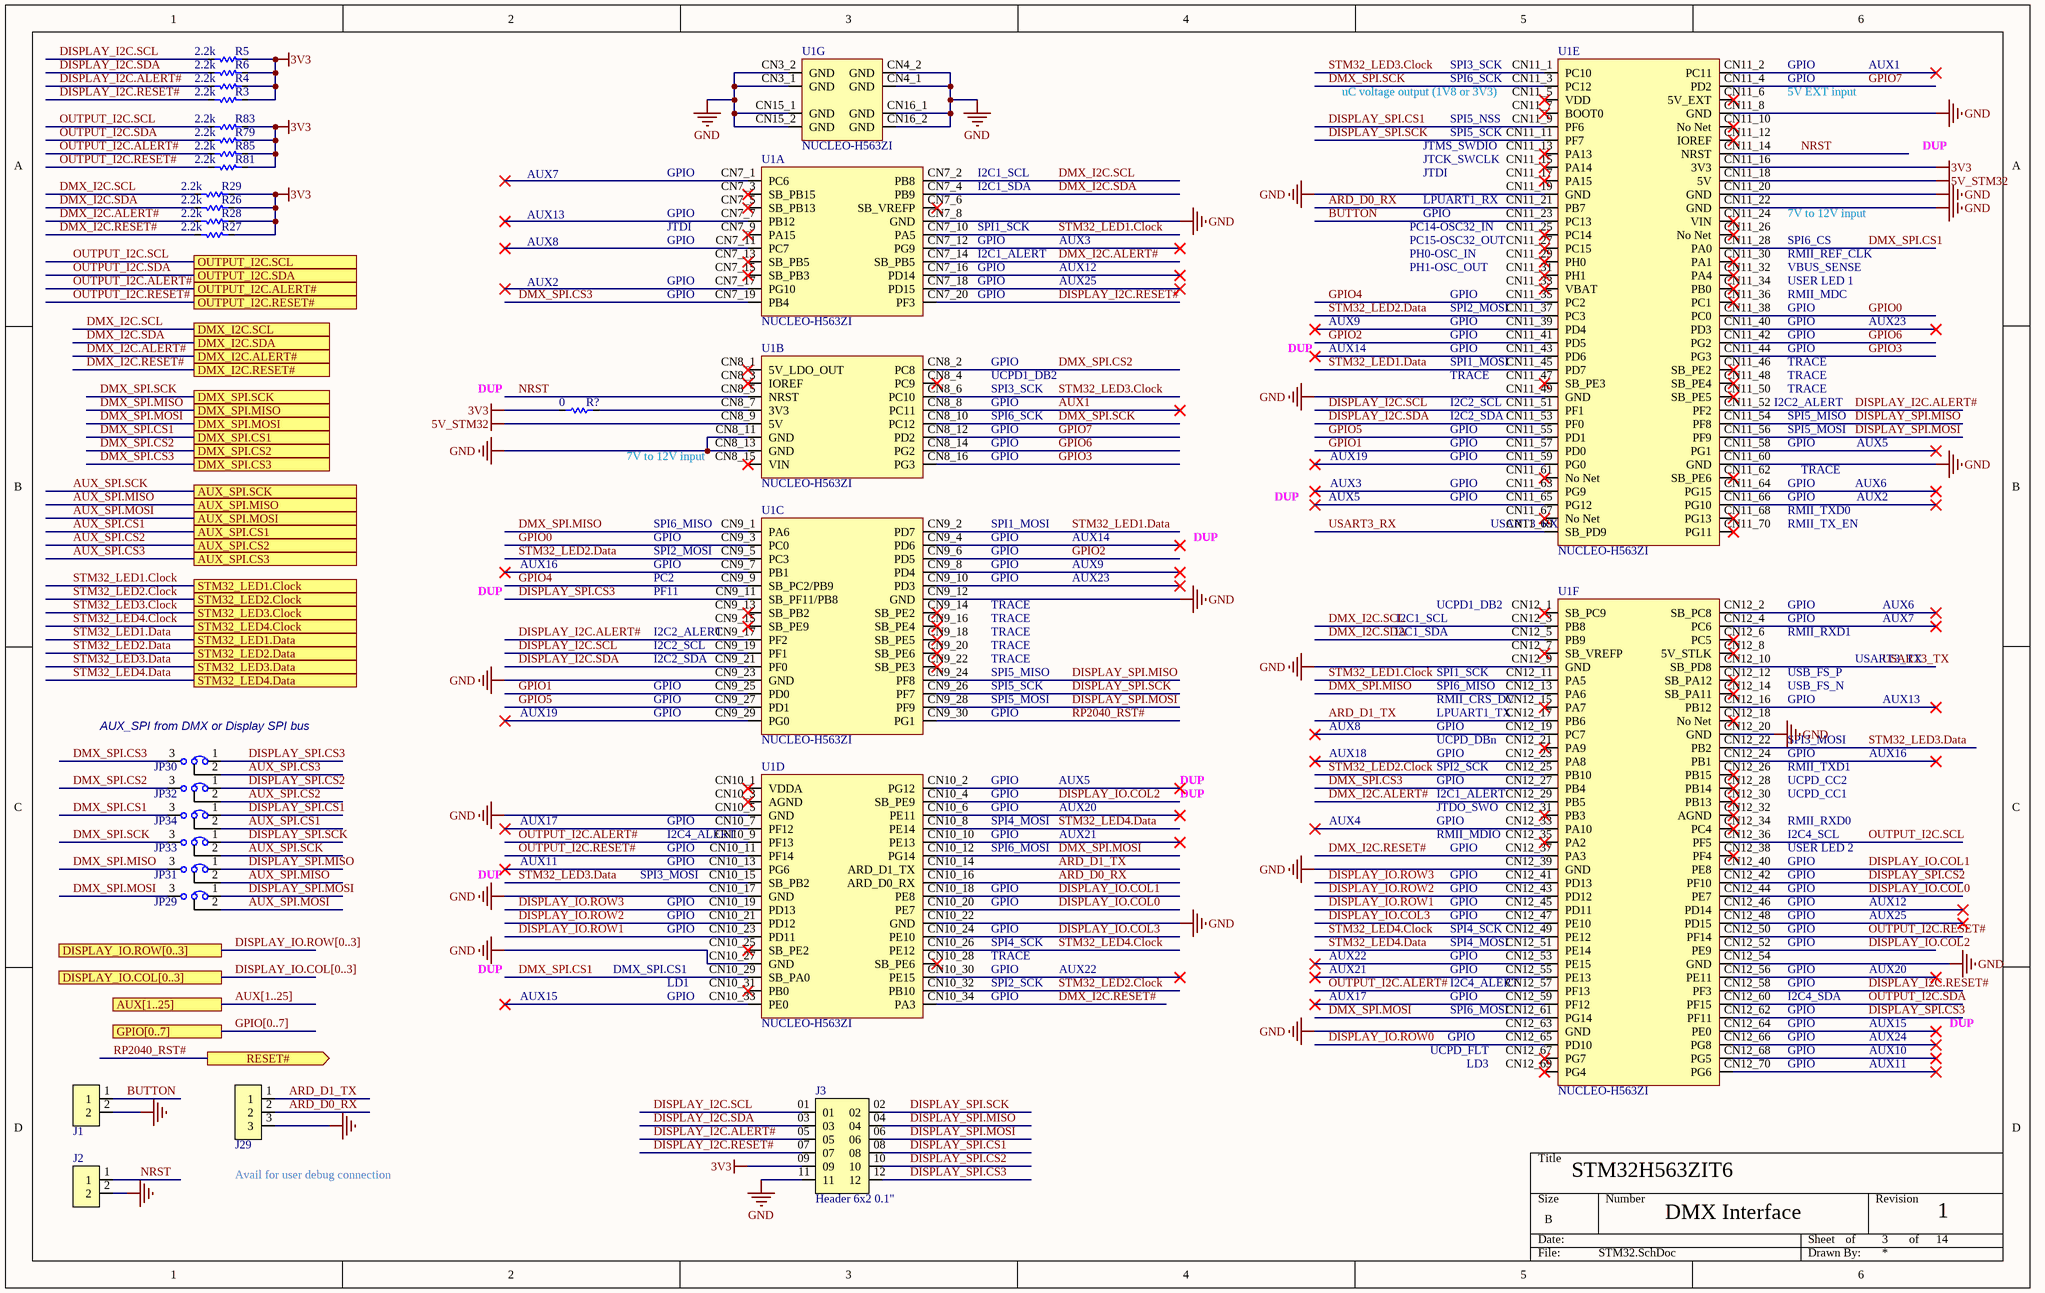
[diagram p8: STM32.SchDoc]

### Parts
J1  Header 2x1 0.1"  [FP-M20-9990245-MFG]  (value not drawn)
J2  Header 2x1 0.1"  [FP-M20-9990245-MFG]  (value not drawn)
J3  Header 6x2 0.1"  [HEADER 6x2 0.1 Through hole]
J29  Header 3x1 0.1"  [FP-PR20203VBNN-MFG]  (value not drawn)
JP29  Jumper 3 x 1 Bridge 1-2 Solder Bridge  [Jumper 3 Solder Bridge 1-2 0603]  (value not drawn)
JP30  Jumper 3 x 1 Bridge 1-2 Solder Bridge  [Jumper 3 Solder Bridge 1-2 0603]  (value not drawn)
JP31  Jumper 3 x 1 Bridge 1-2 Solder Bridge  [Jumper 3 Solder Bridge 1-2 0603]  (value not drawn)
JP32  Jumper 3 x 1 Bridge 1-2 Solder Bridge  [Jumper 3 Solder Bridge 1-2 0603]  (value not drawn)
JP33  Jumper 3 x 1 Bridge 1-2 Solder Bridge  [Jumper 3 Solder Bridge 1-2 0603]  (value not drawn)
JP34  Jumper 3 x 1 Bridge 1-2 Solder Bridge  [Jumper 3 Solder Bridge 1-2 0603]  (value not drawn)
R3  value 2.2k  [RESC1608X06N_0603_MED]  (hidden comment: RC0603FR-072K2L)
R4  value 2.2k  [RESC1608X06N_0603_MED]  (hidden comment: RC0603FR-072K2L)
R5  value 2.2k  [RESC1608X06N_0603_MED]  (hidden comment: RC0603FR-072K2L)
R6  value 2.2k  [RESC1608X06N_0603_MED]  (hidden comment: RC0603FR-072K2L)
R26  value 2.2k  [RESC1608X06N_0603_MED]  (hidden comment: RC0603FR-072K2L)
R27  value 2.2k  [RESC1608X06N_0603_MED]  (hidden comment: RC0603FR-072K2L)
R28  value 2.2k  [RESC1608X06N_0603_MED]  (hidden comment: RC0603FR-072K2L)
R29  value 2.2k  [RESC1608X06N_0603_MED]  (hidden comment: RC0603FR-072K2L)
R79  value 2.2k  [RESC1608X06N_0603_MED]  (hidden comment: RC0603FR-072K2L)
R81  value 2.2k  [RESC1608X06N_0603_MED]  (hidden comment: RC0603FR-072K2L)
R83  value 2.2k  [RESC1608X06N_0603_MED]  (hidden comment: RC0603FR-072K2L)
R85  value 2.2k  [RESC1608X06N_0603_MED]  (hidden comment: RC0603FR-072K2L)
R?  value 0  [RESC1608X06N_0603_MED]  (hidden comment: RC0603FR-070RL)
U1  NUCLEO-H563ZI  [NUCLEO-H563ZI-Below-Footprint]  (parts A,B,C,D,E,F,G of 7)

### Ports
AUX[1..25], AUX_SPI.CS1, AUX_SPI.CS2, AUX_SPI.CS3, AUX_SPI.MISO, AUX_SPI.MOSI, AUX_SPI.SCK, DISPLAY_IO.COL[0..3], DISPLAY_IO.ROW[0..3], DMX_I2C.ALERT#, DMX_I2C.RESET#, DMX_I2C.SCL, DMX_I2C.SDA, DMX_SPI.CS1, DMX_SPI.CS2, DMX_SPI.CS3, DMX_SPI.MISO, DMX_SPI.MOSI, DMX_SPI.SCK, GPIO[0..7], OUTPUT_I2C.ALERT#, OUTPUT_I2C.RESET#, OUTPUT_I2C.SCL, OUTPUT_I2C.SDA, RESET# (out), STM32_LED1.Clock, STM32_LED1.Data, STM32_LED2.Clock, STM32_LED2.Data, STM32_LED3.Clock, STM32_LED3.Data, STM32_LED4.Clock, STM32_LED4.Data

### Nets
3V3: J3.09 R3.2 R4.2 R5.2 R6.2 R26.2 R27.2 R28.2 R29.2 R79.2 R81.2 R83.2 R85.2 R?.1 U1.CN11_16(3V3)
5V_STM32: U1.CN8_9(5V) U1.CN11_18(5V)
GND: J1.2 J2.2 J3.11 J29.3 U1.CN3_1(GND) U1.CN3_2(GND) U1.CN4_1(GND) U1.CN4_2(GND) U1.CN7_8(GND) U1.CN8_11(GND) U1.CN8_13(GND) U1.CN9_12(GND) U1.CN9_23(GND) U1.CN10_5(GND) U1.CN10_17(GND) U1.CN10_22(GND) U1.CN10_27(GND) U1.CN11_8(GND) U1.CN11_19(GND) U1.CN11_20(GND) U1.CN11_22(GND) U1.CN11_49(GND) U1.CN11_60(GND) U1.CN12_9(GND) U1.CN12_20(GND) U1.CN12_39(GND) U1.CN12_54(GND) U1.CN12_63(GND) U1.CN15_1(GND) U1.CN15_2(GND) U1.CN16_1(GND) U1.CN16_2(GND)
ARD_D0_RX: J29.2 U1.CN10_16(ARD_D0_RX) U1.CN11_21(PB7)
ARD_D1_TX: J29.1 U1.CN10_14(ARD_D1_TX) U1.CN12_17(PB6)
AUX1: U1.CN8_8(PC11)
AUX_SPI.CS1: JP34.2 ; port AUX_SPI.CS1
AUX_SPI.CS2: JP32.2 ; port AUX_SPI.CS2
AUX_SPI.CS3: JP30.2 ; port AUX_SPI.CS3
AUX_SPI.MISO: JP31.2 ; port AUX_SPI.MISO
AUX_SPI.MOSI: JP29.2 ; port AUX_SPI.MOSI
AUX_SPI.SCK: JP33.2 ; port AUX_SPI.SCK
BUTTON: J1.1 U1.CN11_23(PC13)
DISPLAY_I2C.ALERT#: J3.05 R4.1 U1.CN9_17(PF2) U1.CN11_52(PF2)
DISPLAY_I2C.RESET#: J3.07 R3.1 U1.CN7_20(PF3) U1.CN12_58(PF3)
DISPLAY_I2C.SCL: J3.01 R5.1 U1.CN9_19(PF1) U1.CN11_51(PF1)
DISPLAY_I2C.SDA: J3.03 R6.1 U1.CN9_21(PF0) U1.CN11_53(PF0)
DISPLAY_IO.COL0: U1.CN10_20(PE7) U1.CN12_44(PE7)
DISPLAY_IO.COL1: U1.CN10_18(PE8) U1.CN12_40(PE8)
DISPLAY_IO.COL2: U1.CN10_4(SB_PE9) U1.CN12_52(PE9)
DISPLAY_IO.COL3: U1.CN10_24(PE10) U1.CN12_47(PE10)
DISPLAY_IO.ROW0: U1.CN12_65(PD10)
DISPLAY_IO.ROW1: U1.CN10_23(PD11) U1.CN12_45(PD11)
DISPLAY_IO.ROW2: U1.CN10_21(PD12) U1.CN12_43(PD12)
DISPLAY_IO.ROW3: U1.CN10_19(PD13) U1.CN12_41(PD13)
DISPLAY_SPI.CS1: J3.08 JP34.1 U1.CN11_9(PF6)
DISPLAY_SPI.CS2: J3.10 JP32.1 U1.CN12_42(PF10)
DISPLAY_SPI.CS3: J3.12 JP30.1 U1.CN9_11(SB_PF11/PB8) U1.CN12_62(PF11)
DISPLAY_SPI.MISO: J3.04 JP31.1 U1.CN9_24(PF8) U1.CN11_54(PF8)
DISPLAY_SPI.MOSI: J3.06 JP29.1 U1.CN9_28(PF9) U1.CN11_56(PF9)
DISPLAY_SPI.SCK: J3.02 JP33.1 U1.CN9_26(PF7) U1.CN11_11(PF7)
DMX_I2C.ALERT#: R28.1 U1.CN7_14(SB_PB5) U1.CN12_29(PB5) ; port DMX_I2C.ALERT#
DMX_I2C.RESET#: R27.1 U1.CN10_34(PA3) U1.CN12_37(PA3) ; port DMX_I2C.RESET#
DMX_I2C.SCL: R29.1 U1.CN7_2(PB8) U1.CN12_3(PB8) ; port DMX_I2C.SCL
DMX_I2C.SDA: R26.1 U1.CN7_4(PB9) U1.CN12_5(PB9) ; port DMX_I2C.SDA
DMX_SPI.CS1: JP34.3 U1.CN10_29(SB_PA0) U1.CN11_28(PA0) ; port DMX_SPI.CS1
DMX_SPI.CS2: JP32.3 U1.CN8_2(PC8) ; port DMX_SPI.CS2
DMX_SPI.CS3: JP30.3 U1.CN7_19(PB4) U1.CN12_27(PB4) ; port DMX_SPI.CS3
DMX_SPI.MISO: JP31.3 U1.CN9_1(PA6) U1.CN12_13(PA6) ; port DMX_SPI.MISO
DMX_SPI.MOSI: JP29.3 U1.CN10_12(PG14) U1.CN12_61(PG14) ; port DMX_SPI.MOSI
DMX_SPI.SCK: JP33.3 U1.CN8_10(PC12) U1.CN11_3(PC12) ; port DMX_SPI.SCK
GPIO0: U1.CN9_3(PC0) U1.CN11_38(PC0)
GPIO1: U1.CN9_25(PD0) U1.CN11_57(PD0)
GPIO2: U1.CN9_6(PD5) U1.CN11_41(PD5)
GPIO3: U1.CN8_16(PG3) U1.CN11_44(PG3)
GPIO4: U1.CN9_9(SB_PC2/PB9) U1.CN11_35(PC2)
GPIO5: U1.CN9_27(PD1) U1.CN11_55(PD1)
GPIO6: U1.CN8_14(PG2) U1.CN11_42(PG2)
GPIO7: U1.CN8_12(PD2) U1.CN11_4(PD2)
NRST: J2.1 U1.CN8_5(NRST) U1.CN11_14(NRST)
OUTPUT_I2C.ALERT#: R85.1 U1.CN10_9(PF13) U1.CN12_57(PF13) ; port OUTPUT_I2C.ALERT#
OUTPUT_I2C.RESET#: R81.1 U1.CN10_11(PF14) U1.CN12_50(PF14) ; port OUTPUT_I2C.RESET#
OUTPUT_I2C.SCL: R83.1 U1.CN12_36(PF5) ; port OUTPUT_I2C.SCL
OUTPUT_I2C.SDA: R79.1 U1.CN12_60(PF15) ; port OUTPUT_I2C.SDA
RP2040_RST#: U1.CN9_30(PG1) ; port RESET#
STM32_LED1.Clock: U1.CN7_10(PA5) U1.CN12_11(PA5) ; port STM32_LED1.Clock
STM32_LED1.Data: U1.CN9_2(PD7) U1.CN11_45(PD7) ; port STM32_LED1.Data
STM32_LED2.Clock: U1.CN10_32(PB10) U1.CN12_25(PB10) ; port STM32_LED2.Clock
STM32_LED2.Data: U1.CN9_5(PC3) U1.CN11_37(PC3) ; port STM32_LED2.Data
STM32_LED3.Clock: U1.CN8_6(PC10) U1.CN11_1(PC10) ; port STM32_LED3.Clock
STM32_LED3.Data: U1.CN10_15(SB_PB2) U1.CN12_22(PB2) ; port STM32_LED3.Data
STM32_LED4.Clock: U1.CN10_26(PE12) U1.CN12_49(PE12) ; port STM32_LED4.Clock
STM32_LED4.Data: U1.CN10_8(PE14) U1.CN12_51(PE14) ; port STM32_LED4.Data
USART3_RX: U1.CN11_69(SB_PD9)
USART3_TX: U1.CN12_10(SB_PD8)
NetR?_2: R?.2 U1.CN8_7(3V3)

Not connected (* = marked no-connect by the designer): U1 CN7_1(PC6)* CN7_3(SB_PB15)* CN7_5(SB_PB13)* CN7_6(SB_VREFP)* CN7_7(PB12)* CN7_9(PA15)* CN7_11(PC7)* CN7_12(PG9)* CN7_13(SB_PB5)* CN7_15(SB_PB3)* CN7_16(PD14)* CN7_17(PG10)* CN7_18(PD15)* CN8_1(5V_LDO_OUT)* CN8_3(IOREF)* CN8_4(PC9)* CN8_15(VIN)* CN9_4(PD6)* CN9_7(PB1)* CN9_8(PD4)* CN9_10(PD3)* CN9_13(SB_PB2)* CN9_14(SB_PE2)* CN9_15(SB_PE9)* CN9_16(SB_PE4)* CN9_18(SB_PE5)* CN9_20(SB_PE6)* CN9_22(SB_PE3)* CN9_29(PG0)* CN10_1(VDDA)* CN10_2(PG12)* CN10_3(AGND)* CN10_6(PE11)* CN10_7(PF12)* CN10_10(PE13)* CN10_13(PG6)* CN10_25(SB_PE2)* CN10_28(SB_PE6)* CN10_30(PE15)* CN10_31(PB0)* CN10_33(PE0)* CN11_2(PC11)* CN11_5(VDD)* CN11_6(5V_EXT)* CN11_7(BOOT0)* CN11_10(No_Net)* CN11_12(IOREF)* CN11_13(PA13)* CN11_15(PA14)* CN11_17(PA15)* CN11_24(VIN)* CN11_25(PC14)* CN11_26(No_Net)* CN11_27(PC15)* CN11_29(PH0)* CN11_30(PA1)* CN11_31(PH1)* CN11_32(PA4)* CN11_33(VBAT)* CN11_34(PB0)* CN11_36(PC1)* CN11_39(PD4)* CN11_40(PD3)* CN11_43(PD6)* CN11_46(SB_PE2)* CN11_47(SB_PE3)* CN11_48(SB_PE4)* CN11_50(SB_PE5)* CN11_58(PG1)* CN11_59(PG0)* CN11_61(No_Net)* CN11_62(SB_PE6)* CN11_63(PG9)* CN11_64(PG15)* CN11_65(PG12)* CN11_66(PG10)* CN11_67(No_Net)* CN11_68(PG13)* CN11_70(PG11)* CN12_1(SB_PC9)* CN12_2(SB_PC8)* CN12_4(PC6)* CN12_6(PC5)* CN12_7(SB_VREFP)* CN12_8(5V_STLK)* CN12_12(SB_PA12)* CN12_14(SB_PA11)* CN12_15(PA7)* CN12_16(PB12)* CN12_18(No_Net)* CN12_19(PC7)* CN12_21(PA9)* CN12_23(PA8)* CN12_24(PB1)* CN12_26(PB15)* CN12_28(PB14)* CN12_30(PB13)* CN12_31(PB3)* CN12_32(AGND)* CN12_33(PA10)* CN12_34(PC4)* CN12_35(PA2)* CN12_38(PF4)* CN12_46(PD14)* CN12_48(PD15)* CN12_53(PE15)* CN12_55(PE13)* CN12_56(PE11)* CN12_59(PF12)* CN12_64(PE0)* CN12_66(PG8)* CN12_67(PG7)* CN12_68(PG5)* CN12_69(PG4)* CN12_70(PG6)*

### Buses and harness runs
bus AUX[1..25] = port AUX[1..25]
bus DISPLAY_IO.COL[0..3] = port DISPLAY_IO.COL[0..3]
bus DISPLAY_IO.ROW[0..3] = port DISPLAY_IO.ROW[0..3]
bus GPIO[0..7] = port GPIO[0..7]

### Notes on the sheet
- (near U1) uC voltage output (1V8 or 3V3)
- SPI3_SCK
- SPI6_SCK
- 5V EXT input
- GPIO
- AUX1
- JTMS_SWDIO
- JTCK_SWCLK
- SPI5_NSS
- SPI5_SCK
- DUP
- AUX7
- AUX13
- AUX8
- JTDI
- I2C1_SCL
- I2C1_SDA
- SPI1_SCK
- PC14-OSC32_IN
- LPUART1_RX
- 7V to 12V input
- AUX2
- I2C1_ALERT
- AUX3
- AUX12
- AUX25
- PC15-OSC32_OUT
- PH0-OSC_IN
- PH1-OSC_OUT
- SPI6_CS
- RMII_REF_CLK
- VBUS_SENSE
- RMII_MDC
- USER LED 1
- AUX9
- AUX14
- (near U1) SPI2_MOSI
- (near U1) SPI1_MOSI
- TRACE
- AUX23
- UCPD1_DB2
- I2C2_SCL
- I2C2_SDA
- I2C2_ALERT
- SPI5_MISO
- SPI5_MOSI
- AUX5
- AUX19
- AUX6
- AUX16
- (near U1) SPI6_MISO
- SPI1_MOSI
- USART3_RX
- RMII_TXD0
- RMII_TX_EN
- (near U1) I2C2_ALERT
- PC2
- PF11
- RMII_RXD1
- RMII_CRS_DV
- SPI6_MISO
- USB_FS_P
- USB_FS_N
- USART3_TX
- (near JP30) AUX_SPI from DMX or Display SPI bus
- AUX18
- LPUART1_TX
- UCPD_DBn
- SPI2_SCK
- SPI3_MOSI
- RMII_TXD1
- AUX17
- (near U1) I2C4_ALERT
- SPI4_MOSI
- AUX20
- AUX21
- AUX4
- RMII_MDIO
- JTDO_SWO
- I2C4_SCL
- UCPD_CC1
- UCPD_CC2
- RMII_RXD0
- AUX11
- SPI6_MOSI
- USER LED 2
- DMX_SPI.CS1
- SPI4_SCK
- AUX22
- (near U1) SPI4_MOSI
- AUX15
- LD1
- (near U1) SPI6_MOSI
- I2C4_SDA
- AUX24
- UCPD_FLT
- LD3
- AUX10
- (near J29) Avail for user debug connection
- of

### Library data of the parts
J1 J2 = CMP-002-00082-2: Conn Header Vert 2POS 2.54MM; Connector Type: BOARD CONNECTOR; RoHS Compliant: Yes; Min Operating Temperature: -40°C; Mounting Technology: Through Hole; Pins: 2; Max Operating Temperature: 105°C
J3 = CMP-002-00221-2: Board Connector Tall, 12 Contact(s), 2 Row(s), Male, Straight, 0.1 inch Pitch; Max Current Rating: 3A; Connector Type: Header; Gender: Male; Pins: 12; Mounting Technology: Board; RoHS Compliant: Yes
J29 = CMP-002-00081-5: Conn Header Vert 3POS 2.54MM; Pins: 3
JP29-JP34 = CMP-009-00341-2: 0603 Solder Bridge Jumper Surface Mount; Voltage Rating: 75V; Tolerance: 1%; Value: 0; Max Operating Temperature: 155°C; Pins: 2; Case/Package: 0603; Min Operating Temperature: -55°C; RoHS Compliant: Yes; Mounting Technology: Surface Mount
R3-R6 R26-R29 R79 R81 R83 R85 = CMP-009-00304-2: Fixed Resistor, Metal Glaze/thick Film, 0.1W, 2200ohm, 75V, 1% +/-Tol, 100ppm/Cel, Surface Mount, 0603; Power: 100mW; Voltage Rating: 50V; Min Operating Temperature: -55°C; Max Operating Temperature: 155°C; Tolerance: 1%; Case/Package: 0603; Pins: 2; Mounting Technology: Surface Mount; RoHS Compliant: Yes; JLCPN: C114662
R? = CMP-009-00204-3: as R1 on sheet Microcontroller; Min Operating Temperature: -55°C; Pins: 2; Case/Package: 0603; Max Operating Temperature: 155°C; RoHS Compliant: Yes; Mounting Technology: Surface Mount; JLCPN: C100044
U1 = CMP-020-00024-9: Dev Nucleo Board, 32Bit, Arm, Cortex-M Rohs Compliant: Yes

## Sheet SmartLED.SchDoc: Smart LED
size B; SheetNumber: 2; SheetTotal: 6
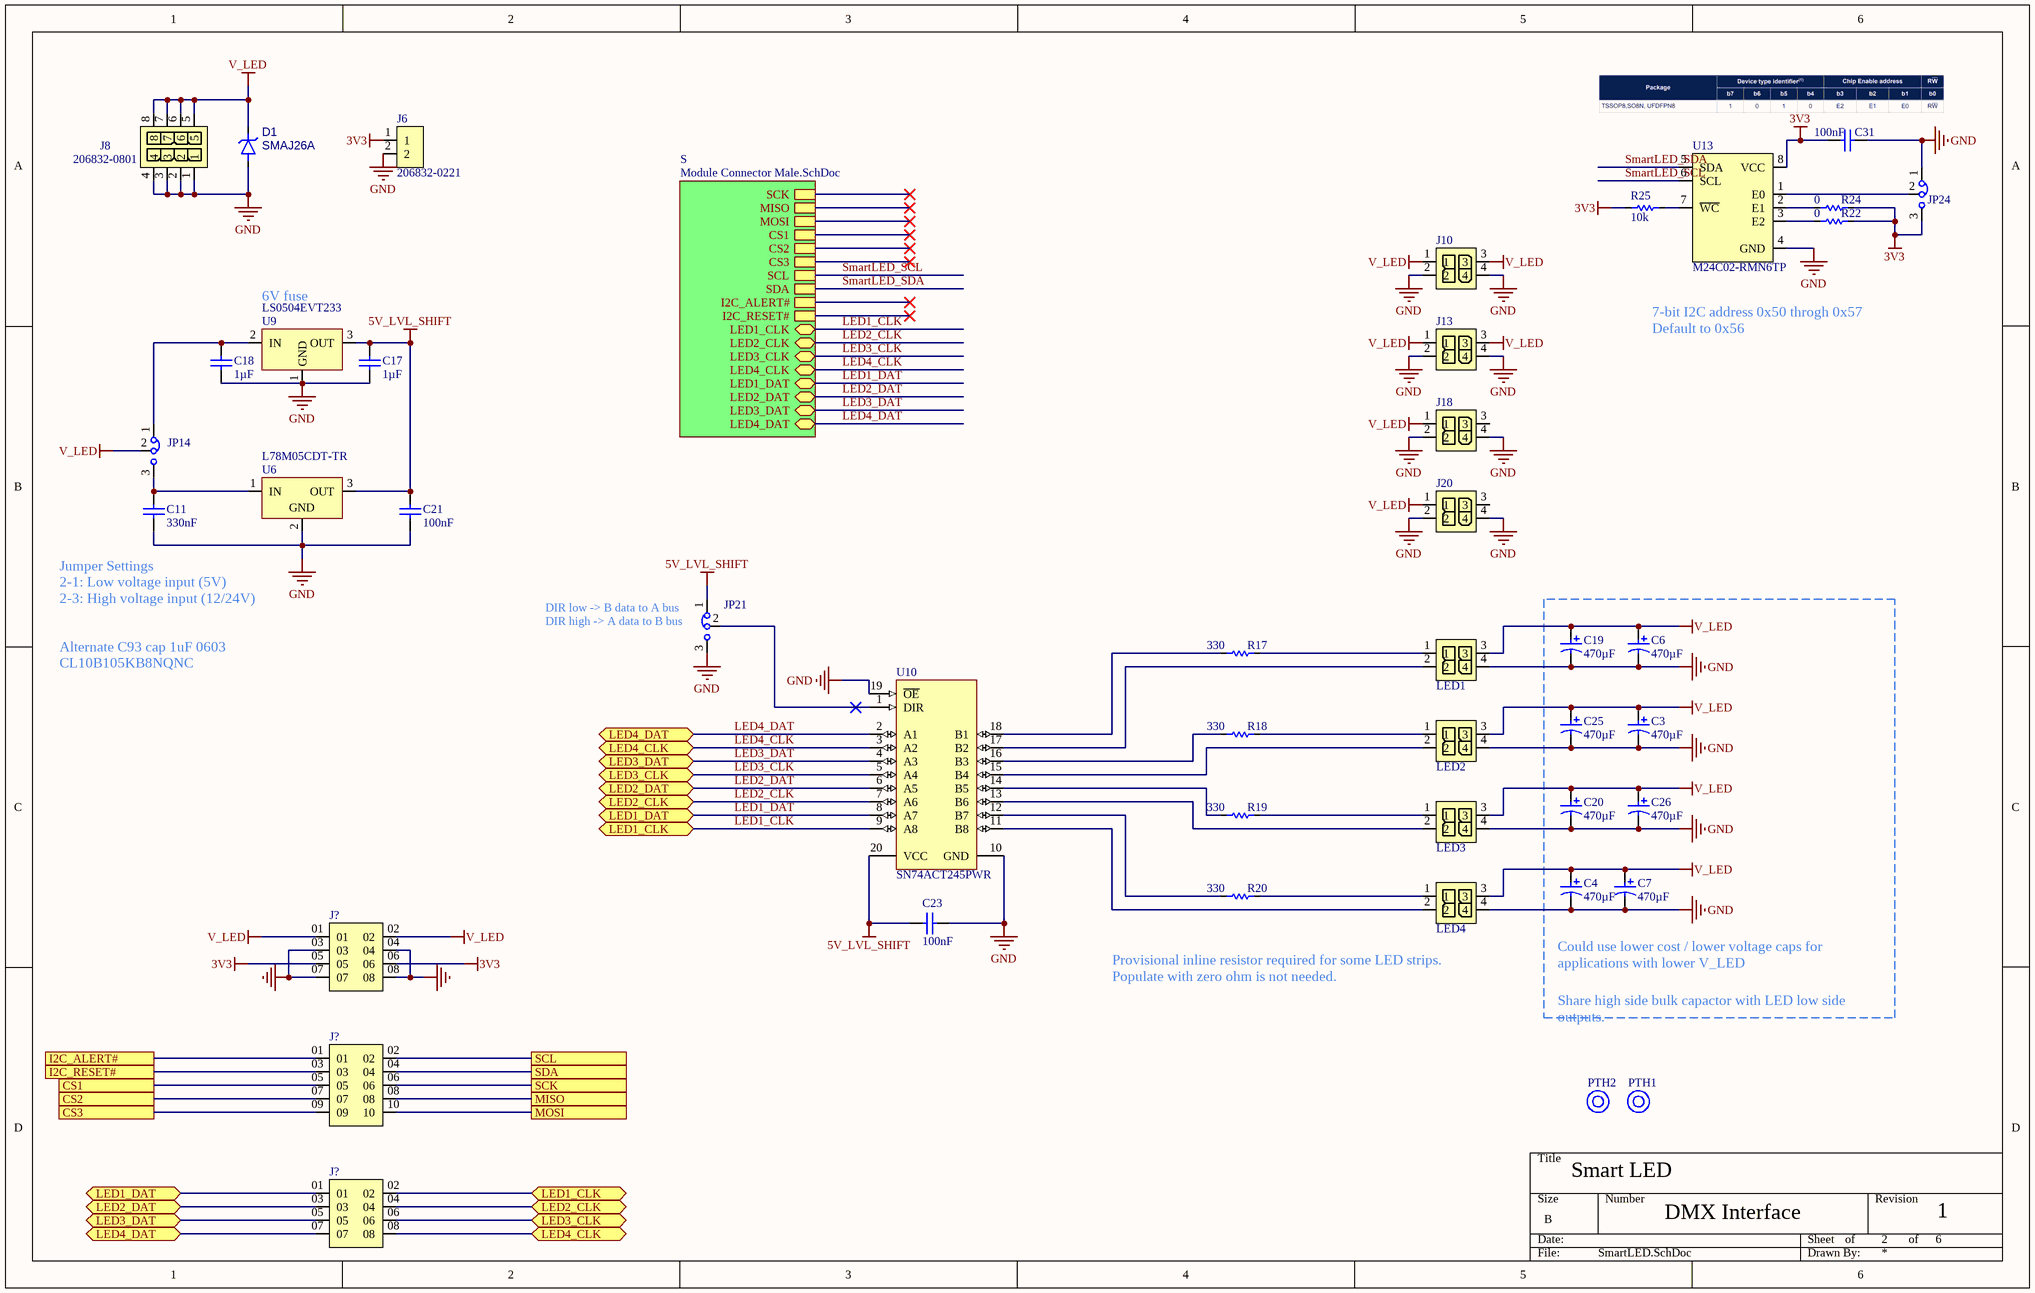
[diagram p9: SmartLED.SchDoc]

### Parts
(Parts that share a designator on the sheet are numbered #1, #2 ... from top to bottom, then left to right.)
C3  value 470µF  [CAP_POL_DIAM10_H22_SPACING5]  (hidden comment: REH1020471M050K)
C4  value 470µF  [CAP_POL_DIAM10_H22_SPACING5]  (hidden comment: REH1020471M050K)
C6  value 470µF  [CAP_POL_DIAM10_H22_SPACING5]  (hidden comment: REH1020471M050K)
C7  value 470µF  [CAP_POL_DIAM10_H22_SPACING5]  (hidden comment: REH1020471M050K)
C11  value 330nF  [CAPC1608X10N_0603_MED]  (hidden comment: CGA3E3X7R1H334K080AB)
C17  value 1µF  [CAPC1608X10N_0603_MED]  (hidden comment: C1608X7R1C105K080AC)
C18  value 1µF  [CAPC2012X14N_0805_MED]  (hidden comment: CL21B105KBFNNNE)
C19  value 470µF  [CAP_POL_DIAM10_H22_SPACING5]  (hidden comment: REH1020471M050K)
C20  value 470µF  [CAP_POL_DIAM10_H22_SPACING5]  (hidden comment: REH1020471M050K)
C21  value 100nF  [CAPC1608X10N_0603_MED]  (hidden comment: CC0603KRX7R0BB104)
C23  value 100nF  [CAPC1608X10N_0603_MED]  (hidden comment: CC0603KRX7R0BB104)
C25  value 470µF  [CAP_POL_DIAM10_H22_SPACING5]  (hidden comment: REH1020471M050K)
C26  value 470µF  [CAP_POL_DIAM10_H22_SPACING5]  (hidden comment: REH1020471M050K)
C31  value 100nF  [CAPC1608X10N_0603_MED]  (hidden comment: CC0603KRX7R0BB104)
D1  SMAJ26A  [FP-SMAJ-MFG]
J6  206832-0221  [206832-0221-Footprint-1]
J8  206832-0801  [206832-0801-Footprint-1]
J10  212528-0430  [212528-0430-Footprint-1]  (value not drawn)
J13  212528-0430  [212528-0430-Footprint-1]  (value not drawn)
J18  212528-0430  [212528-0430-Footprint-1]  (value not drawn)
J20  212528-0430  [212528-0430-Footprint-1]  (value not drawn)
J?#1  Header 4x2 0.1" RA  [Header 4x2 0.1" RA]  (value not drawn)
J?#2  Header 5x2 0.1" RA  [Header 5x2 0.1" RA]  (value not drawn)
J?#3  Header 4x2 0.1" RA  [Header 4x2 0.1" RA]  (value not drawn)
JP14  Jumper 3 x 1 Bridge 1-2 0.1"  [FP-PR20203VBNN-MFG]  (value not drawn)
JP21  Jumper 3 x 1 Bridge 1-2 Solder Bridge  [Jumper 3 Solder Bridge 1-2 0603]  (value not drawn)
JP24  Jumper 3 x 1 Bridge 1-2 Solder Bridge  [Jumper 3 Solder Bridge 1-2 0603]  (value not drawn)
LED1  212528-0400  [212528-0400-Footprint-1]  (value not drawn)
LED2  212528-0400  [212528-0400-Footprint-1]  (value not drawn)
LED3  212528-0400  [212528-0400-Footprint-1]  (value not drawn)
LED4  212528-0400  [212528-0400-Footprint-1]  (value not drawn)
PTH1  Mounting Hole NPTH  [Mounting Hole M3 No Washer NPTH]  (value not drawn)  (no BOM)
PTH2  Mounting Hole NPTH  [Mounting Hole M3 No Washer NPTH]  (value not drawn)  (no BOM)
R17  value 330  [RESC1608X06N_0603_MED]  (hidden comment: RC0603FR-07330RL)
R18  value 330  [RESC1608X06N_0603_MED]  (hidden comment: RC0603FR-07330RL)
R19  value 330  [RESC1608X06N_0603_MED]  (hidden comment: RC0603FR-07330RL)
R20  value 330  [RESC1608X06N_0603_MED]  (hidden comment: RC0603FR-07330RL)
R22  value 0  [RESC1608X06N_0603_MED]  (hidden comment: RC0603FR-070RL)
R24  value 0  [RESC1608X06N_0603_MED]  (hidden comment: RC0603FR-070RL)
R25  value 10k  [RESC1608X06N_0603_MED]  (hidden comment: RC0603FR-1010KL)
U6  L78M05CDT-TR  [L78M05CDT-TR-Footprint-1]
U9  LS0504EVT233  [SOT95P280X100-3N]
U10  SN74ACT245PWR  [PW0020A_L]
U13  M24C02-RMN6TP  [M24C02-RMN6TP-SO8N-IPC_B]

### Sub-sheets
S = Module Connector Male.SchDoc: SCK (harness MOD_CONN), MISO, MOSI, CS1, CS2, CS3, SCL, SDA, I2C_ALERT#, I2C_RESET#, LED1_CLK (bidir), LED2_CLK (bidir), LED3_CLK (bidir), LED4_CLK (bidir), LED1_DAT (bidir), LED2_DAT (bidir), LED3_DAT (bidir), LED4_DAT (bidir)

### Ports
CS1, CS2, CS3, I2C_ALERT#, I2C_RESET#, LED1_CLK (bidir), LED1_DAT (bidir), LED2_CLK (bidir), LED2_DAT (bidir), LED3_CLK (bidir), LED3_DAT (bidir), LED4_CLK (bidir), LED4_DAT (bidir), MISO, MOSI, SCK, SCL, SDA

### Nets
3V3: C31.1 J6.1 J?#1.05 J?#1.06 JP24.3 R22.1 R24.1 R25.2 U13.8(VCC)
5V_LVL_SHIFT: C17.2 C21.1 C23.2 JP21.1 U6.3(OUT) U9.3(OUT) U10.20(VCC)
GND: C3.2 C4.2 C6.2 C7.2 C11.1 C17.1 C18.1 C19.2 C20.2 C21.2 C23.1 C25.2 C26.2 C31.2 D1.2(A) J6.2 J8.1 J8.2 J8.3 J8.4 J10.2 J10.4 J13.2 J13.4 J18.2 J18.4 J20.2 J20.4 J?#1.03 J?#1.04 J?#1.07 J?#1.08 JP21.3 JP24.1 LED1.4 LED2.4 LED3.4 LED4.4 U6.2(GND) U9.1(GND) U10.10(GND) U10.19(~{OE}) U13.4(GND)
V_LED: C3.1 C4.1 C6.1 C7.1 C19.1 C20.1 C25.1 C26.1 D1.1(K) J8.5 J8.6 J8.7 J8.8 J10.1 J10.3 J13.1 J13.3 J18.1 J20.1 J?#1.01 J?#1.02 JP14.2 LED1.3 LED2.3 LED3.3 LED4.3
LED1_CLK: J?#3.02 U10.9(A8) ; port LED1_CLK, sheet S/LED1_CLK
LED1_DAT: J?#3.01 U10.8(A7) ; port LED1_DAT, sheet S/LED1_DAT
LED2_CLK: J?#3.04 U10.7(A6) ; port LED2_CLK, sheet S/LED2_CLK
LED2_DAT: J?#3.03 U10.6(A5) ; port LED2_DAT, sheet S/LED2_DAT
LED3_CLK: J?#3.06 U10.5(A4) ; port LED3_CLK, sheet S/LED3_CLK
LED3_DAT: J?#3.05 U10.4(A3) ; port LED3_DAT, sheet S/LED3_DAT
LED4_CLK: J?#3.08 U10.3(A2) ; port LED4_CLK, sheet S/LED4_CLK
LED4_DAT: J?#3.07 U10.2(A1) ; port LED4_DAT, sheet S/LED4_DAT
SmartLED_SCL: U13.6(SCL) ; sheet S/SCL
SmartLED_SDA: U13.5(SDA) ; sheet S/SDA
NetC11_2: C11.2 JP14.3 U6.1(IN)
NetC18_2: C18.2 JP14.1 U9.2(IN)
NetJ?#2_01: J?#2.01 ; port I2C_ALERT#
NetJ?#2_02: J?#2.02 ; port SCL
NetJ?#2_03: J?#2.03 ; port I2C_RESET#
NetJ?#2_04: J?#2.04 ; port SDA
NetJ?#2_05: J?#2.05 ; port CS1
NetJ?#2_06: J?#2.06 ; port SCK
NetJ?#2_07: J?#2.07 ; port CS2
NetJ?#2_08: J?#2.08 ; port MISO
NetJ?#2_09: J?#2.09 ; port CS3
NetJ?#2_10: J?#2.10 ; port MOSI
NetJP21_2: JP21.2 U10.1(DIR)
NetJP24_2: JP24.2 U13.1(E0)
NetLED1_1: LED1.1 R17.2
NetLED1_2: LED1.2 U10.17(B2)
NetLED2_1: LED2.1 R18.2
NetLED2_2: LED2.2 U10.15(B4)
NetLED3_1: LED3.1 R19.2
NetLED3_2: LED3.2 U10.13(B6)
NetLED4_1: LED4.1 R20.2
NetLED4_2: LED4.2 U10.11(B8)
NetR17_1: R17.1 U10.18(B1)
NetR18_1: R18.1 U10.16(B3)
NetR19_1: R19.1 U10.14(B5)
NetR20_1: R20.1 U10.12(B7)
NetR22_2: R22.2 U13.3(E2)
NetR24_2: R24.2 U13.2(E1)
NetR25_1: R25.1 U13.7(~{WC})

Not connected (* = marked no-connect by the designer): J18 3; J20 3

### Notes on the sheet
- (near U9) 6V fuse
- 7-bit I2C address 0x50 throgh 0x57
  Default to 0x56
- Jumper Settings
  2-1: Low voltage input (5V)
  2-3: High voltage input (12/24V)
- (near JP21) DIR low -> B data to A bus
  DIR high -> A data to B bus
- Alternate C93 cap 1uF 0603 CL10B105KB8NQNC
- Could use lower cost / lower voltage caps for applications with lower V_LED
- Provisional inline resistor required for some LED strips. Populate with zero ohm is not needed.
- Share high side bulk capactor with LED low side outputs.
- of

### Library data of the parts
C3 C4 C6 C7 C19 C20 C25 C26 = CMP-001-00166-1: as C72 on sheet LED_low_side_connector; RoHS Compliant: Yes; Case/Package: Radial; Tolerance: 20%; Voltage Rating: 50V; Min Operating Temperature: 125°C; Max Operating Temperature: -40°C; Mounting Technology: Through Hole; Pins: 2
C11 = CMP-001-00167-2: Ceramic Capacitor, Multilayer, Ceramic, 50V, 10% +Tol, 10% -Tol, X7R, 15% TC, 0.33uF, Surface Mount, 0603; Voltage Rating: 100V; Case/Package: 0603; Min Operating Temperature: -55°C; RoHS Compliant: Yes; Max Operating Temperature: 125°C; Pins: 2; Capacitor Type: Ceramic; Mounting Technology: Surface Mount; JLCPN: C5199872
C17 = CMP-001-00121-2: Ceramic Capacitor, Multilayer, Ceramic, 16V, 10% +Tol, 10% -Tol, X7R, 15% TC, 1uF, Surface Mount, 0603; Capacitor Type: Ceramic; RoHS Compliant: Yes; Min Operating Temperature: -55°C; Pins: 2; Tolerance: 10%; Max Operating Temperature: 125°C; Mounting Technology: Surface Mount; Voltage Rating: 16V; Case/Package: 0603; JLCPN: C59782
C18 = CMP-001-00171-2: Ceramic Capacitor, Multilayer, Ceramic, 1uF, 50V, 10%, XRS, 0805; Max Operating Temperature: 125°C; RoHS Compliant: Yes; Mounting Technology: Surface Mount; Case/Package: 0805; Tolerance: 10%; Pins: 2; Voltage Rating: 50V; Min Operating Temperature: -55°C; Capacitor Type: Ceramic; JLCPN: C28323
C21 C23 C31 = CMP-001-00102-4: as C34 on sheet LED_low_side_control; Max Operating Temperature: 125°C; RoHS Compliant: Yes; Case/Package: 0603; Mounting Technology: Surface Mount; Capacitor Type: Ceramic; Pins: 2; Voltage Rating: 100V; Min Operating Temperature: -55°C; JLCPN: C113803
D1 = CMP-004-00046-2: as D7 on sheet LED_low_side_control; Min Operating Temperature: -65°C; RoHS Compliant: Yes; Max Operating Temperature: 150°C; Pins: 2; JLCPN: C148225
J6 = CMP-002-00210-4: as J31 on sheet LED_low_side_control; Pins: 2; Connector Type: Micro-Fit+
J8 = CMP-002-00208-6: as J32 on sheet LED_low_side_control; Connector Type: Micro-Fit+; Mounting Technology: Through Hole; Pins: 8
J10 J13 J18 J20 = CMP-002-00220-4: Micro-Fit+, RA Header, 4 Position, Blue D-Key; Max Current Rating: 12.5A; Gender: Male; Mounting Technology: Through Hole; Max Operating Temperature: 125°C; Pins: 4; Min Operating Temperature: -40°C; Connector Type: Micro-Fit+
J?#1 J?#3 = CMP-002-00226-4: as J9 on sheet Module Connector Male; Connector Type: BOARD CONNECTOR; RoHS Compliant: Yes; Max Operating Temperature: 105°C; Min Operating Temperature: -40°C; Mounting Technology: Board; Pins: 8
J?#2 = CMP-002-00230-4: as J12 on sheet Module Connector Male; Min Operating Temperature: -40°C; Pins: 10; Mounting Technology: Board; Max Operating Temperature: 125°C; Connector Type: BOARD CONNECTOR; RoHS Compliant: Yes
JP14 = CMP-002-00084-6: Pins: 3
JP21 JP24 = CMP-009-00341-2: as JP25 on sheet LED_low_side_control; Pins: 2; Case/Package: 0603; RoHS Compliant: Yes; Max Operating Temperature: 155°C; Min Operating Temperature: -55°C; Mounting Technology: Surface Mount
LED1-LED4 = CMP-002-00219-3: Micro-Fit+, RA Header, 4 Position, Black A-Key; Gender: Male; Max Current Rating: 12.5A; Connector Type: Micro-Fit+; Pins: 4; Mounting Technology: Through Hole
PTH1 PTH2 = CMP-00028-00043-3
R17-R20 = CMP-009-00302-2: Fixed Resistor, Metal Glaze/thick Film, 0.1W, 330ohm, 75V, 1% +/-Tol, 100ppm/Cel, Surface Mount, 0603; Power: 100mW; Voltage Rating: 50V; Min Operating Temperature: -55°C; Pins: 2; RoHS Compliant: Yes; Tolerance: 1%; Mounting Technology: Surface Mount; Max Operating Temperature: 155°C; Case/Package: 0603; JLCPN: C105881
R22 R24 = CMP-009-00204-3: as R31 on sheet LED_low_side_control; Mounting Technology: Surface Mount; Pins: 2; Case/Package: 0603; Max Operating Temperature: 155°C; Min Operating Temperature: -55°C; RoHS Compliant: Yes; JLCPN: C100044
R25 = CMP-009-00306-2: as R30 on sheet LED_low_side_control; Max Operating Temperature: 155°C; Case/Package: 0603; Mounting Technology: Surface Mount; Tolerance: 1%; Min Operating Temperature: -55°C; RoHS Compliant: Yes; Pins: 2; JLCPN: C98220
U6 = CMP-019-00076-2: Fixed Positive Standard Regulator, 5VBIPolar, PSSO2; Output Current: 500mA; Output Voltage: 5V; Max Supply Voltage: 25V; RoHS Compliant: Yes; Pins: 2; Case/Package: TO-252; JLCPN: C55509
U9 = CMP-005-00015-4: E-Fuse, LS0504 Series Single Channel 4 A High Side SMT Power Switch - SOT-23-3; Current Rating: 4A; Case/Package: SOT-23; Pins: 3
U10 = CMP-016-00027-3: Bus Transceiver, ACT Series, 1-Func, 8-Bit, True Output, CMOS, PDSO20; Min Supply Voltage: 4.5V; Max Supply Voltage: 5.5V; Nominal Supply Voltage: 5V; Min Operating Temperature: -40°C; RoHS Compliant: Yes; Case/Package: TSSOP; Pins: 20; Max Operating Temperature: 85°C; Logic Type: BUS TRANSCEIVER; JLCPN: C6931
U13 = CMP-019-00078-2: as U15 on sheet LED_low_side_control; Case/Package: SOIC; Pins: 8; Clock Frequency: 400kHz; Min Operating Temperature: -40°C; Memory Format: EEPROM; Max Operating Temperature: 85°C; Mounting Technology: Surface Mount; JLCPN: C83836

## Sheet LED_high_power.SchDoc: LED High Power
size B; SheetNumber: 12; SheetTotal: 14
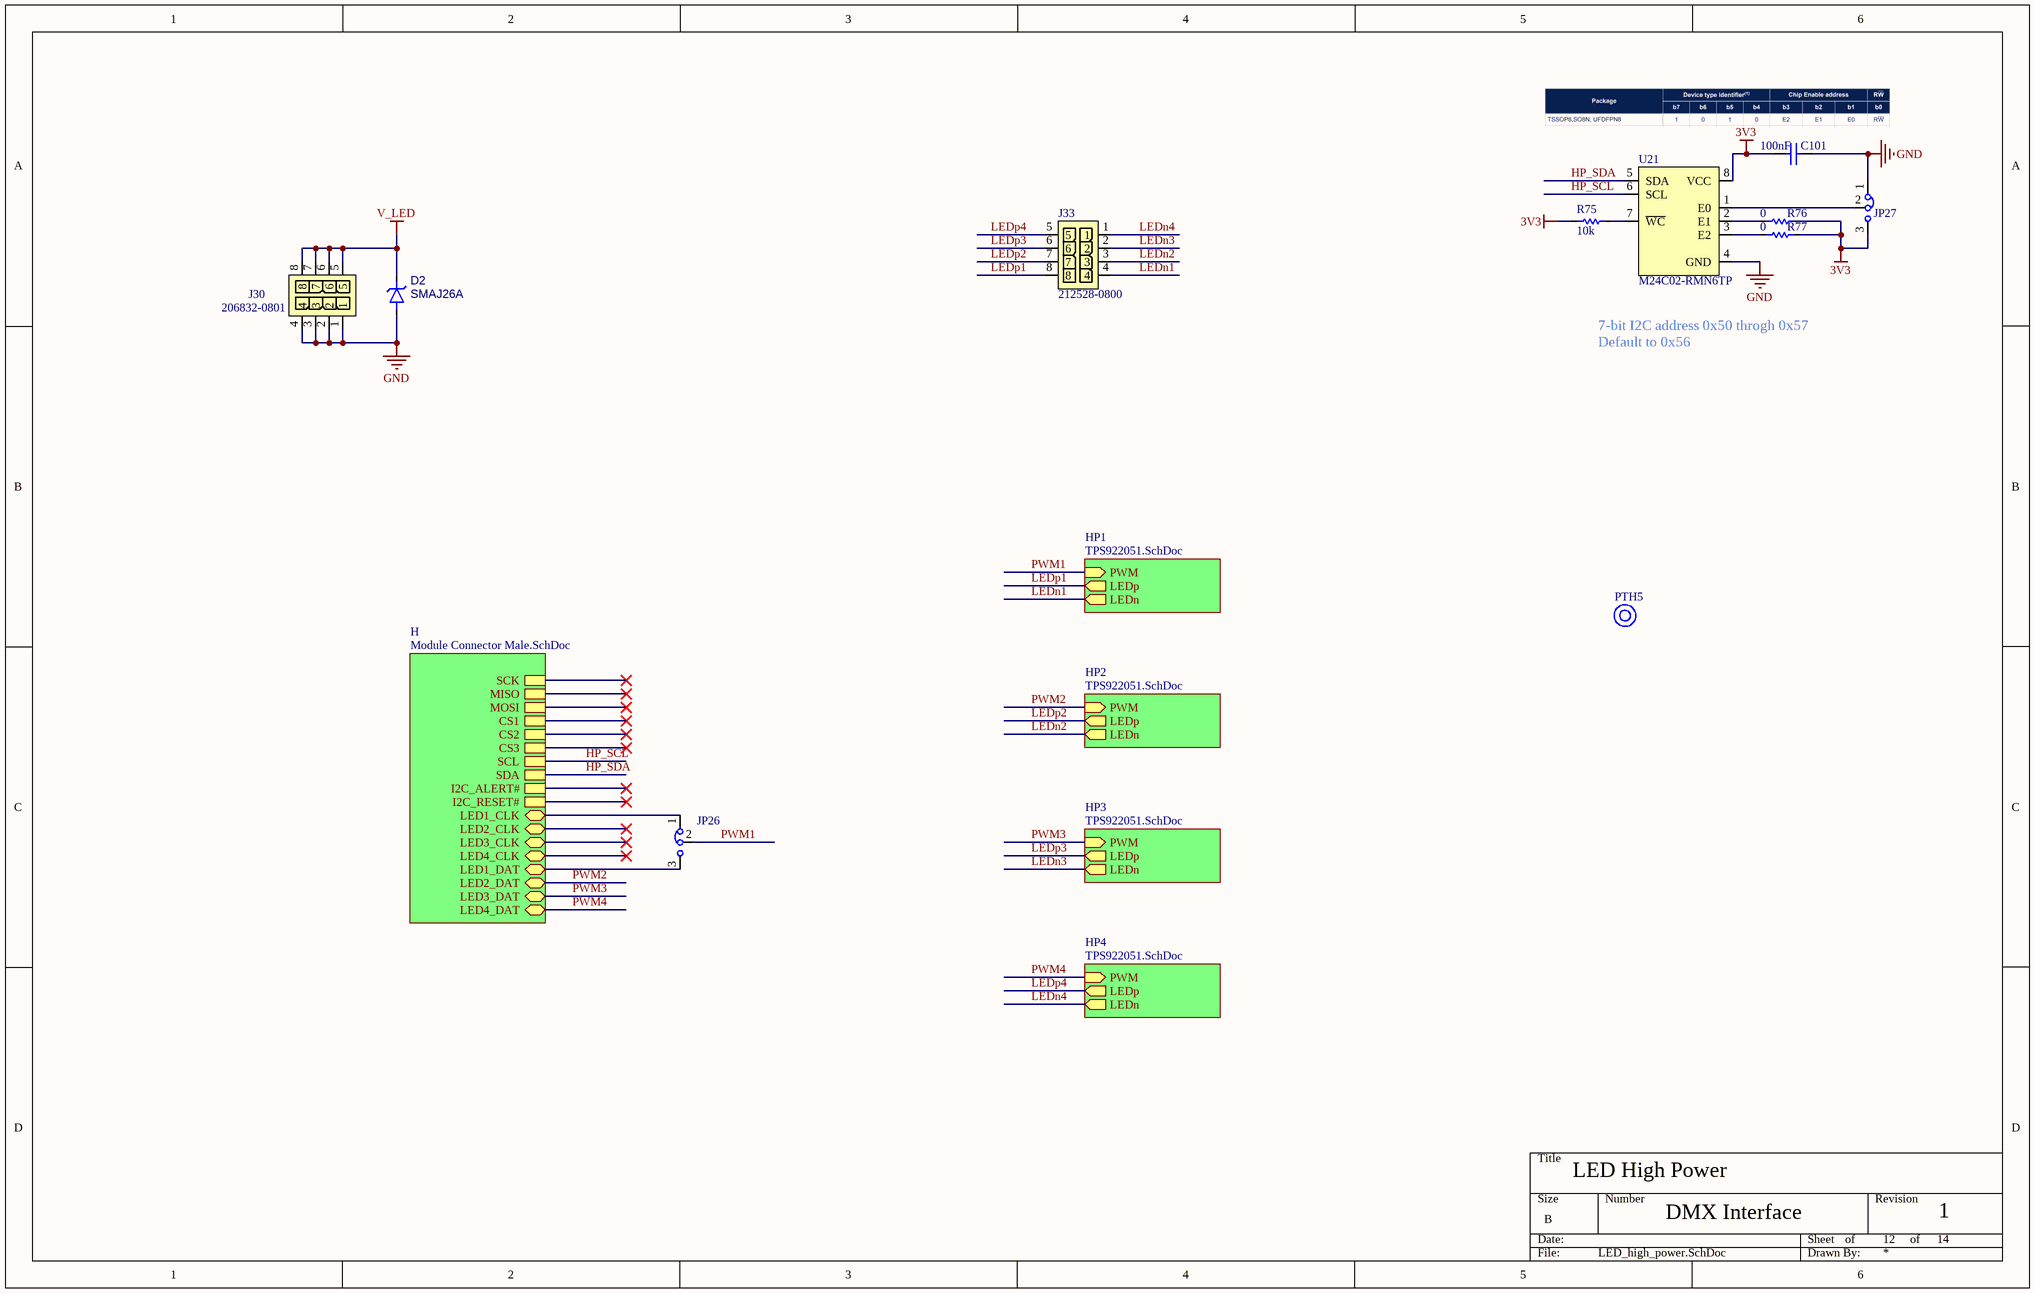
[diagram p10: LED_high_power.SchDoc]

### Parts
C101  value 100nF  [CAPC1608X10N_0603_MED]  (hidden comment: CC0603KRX7R0BB104)
D2  SMAJ26A  [FP-SMAJ-MFG]
J30  206832-0801  [206832-0801-Footprint-1]
J33  212528-0800  [212528-0800-Footprint]
JP26  Jumper 3 x 1 Bridge 1-2 Solder Bridge  [Jumper 3 Solder Bridge 1-2 0603]  (value not drawn)
JP27  Jumper 3 x 1 Bridge 1-2 Solder Bridge  [Jumper 3 Solder Bridge 1-2 0603]  (value not drawn)
PTH5  Mounting Hole NPTH  [Mounting Hole M3 No Washer NPTH]  (value not drawn)  (no BOM)
R75  value 10k  [RESC1608X06N_0603_MED]  (hidden comment: RC0603FR-1010KL)
R76  value 0  [RESC1608X06N_0603_MED]  (hidden comment: RC0603FR-070RL)
R77  value 0  [RESC1608X06N_0603_MED]  (hidden comment: RC0603FR-070RL)
U21  M24C02-RMN6TP  [M24C02-RMN6TP-SO8N-IPC_B]

### Sub-sheets
H = Module Connector Male.SchDoc: SCK, MISO, MOSI, CS1, CS2, CS3, SCL, SDA, I2C_ALERT#, I2C_RESET#, LED1_CLK (bidir), LED2_CLK (bidir), LED3_CLK (bidir), LED4_CLK (bidir), LED1_DAT (bidir), LED2_DAT (bidir), LED3_DAT (bidir), LED4_DAT (bidir)
HP1 = TPS922051.SchDoc: PWM (in), LEDp (out), LEDn (out)
HP2 = TPS922051.SchDoc: PWM (in), LEDp (out), LEDn (out)
HP3 = TPS922051.SchDoc: PWM (in), LEDp (out), LEDn (out)
HP4 = TPS922051.SchDoc: PWM (in), LEDp (out), LEDn (out)

### Nets
3V3: C101.1 JP27.3 R75.2 R76.1 R77.1 U21.8(VCC)
GND: C101.2 D2.2(A) J30.1 J30.2 J30.3 J30.4 JP27.1 U21.4(GND)
V_LED: D2.1(K) J30.5 J30.6 J30.7 J30.8
HP_SCL: U21.6(SCL) ; sheet H/SCL
HP_SDA: U21.5(SDA) ; sheet H/SDA
LEDn1: J33.4 ; sheet HP1/LEDn
LEDn2: J33.3 ; sheet HP2/LEDn
LEDn3: J33.2 ; sheet HP3/LEDn
LEDn4: J33.1 ; sheet HP4/LEDn
LEDp1: J33.8 ; sheet HP1/LEDp
LEDp2: J33.7 ; sheet HP2/LEDp
LEDp3: J33.6 ; sheet HP3/LEDp
LEDp4: J33.5 ; sheet HP4/LEDp
PWM1: JP26.2 ; sheet HP1/PWM
PWM2: sheet H/LED2_DAT, sheet HP2/PWM
PWM3: sheet H/LED3_DAT, sheet HP3/PWM
PWM4: sheet H/LED4_DAT, sheet HP4/PWM
NetJ17_H_01: JP26.3 ; sheet H/LED1_DAT
NetJ17_H_02: JP26.1 ; sheet H/LED1_CLK
NetJP27_2: JP27.2 U21.1(E0)
NetR75_1: R75.1 U21.7(~{WC})
NetR76_2: R76.2 U21.2(E1)
NetR77_2: R77.2 U21.3(E2)

### Notes on the sheet
- 7-bit I2C address 0x50 throgh 0x57
  Default to 0x56
- of

### Library data of the parts
C101 = CMP-001-00102-4: as C34 on sheet LED_low_side_control; Max Operating Temperature: 125°C; RoHS Compliant: Yes; Case/Package: 0603; Mounting Technology: Surface Mount; Capacitor Type: Ceramic; Pins: 2; Voltage Rating: 100V; Min Operating Temperature: -55°C; JLCPN: C113803
D2 = CMP-004-00046-2: as D7 on sheet LED_low_side_control; Min Operating Temperature: -65°C; RoHS Compliant: Yes; Max Operating Temperature: 150°C; Pins: 2; JLCPN: C148225
J30 = CMP-002-00208-6: as J32 on sheet LED_low_side_control; Connector Type: Micro-Fit+; Mounting Technology: Through Hole; Pins: 8
J33 = CMP-002-00231-1: Micro-Fit+ RA Header 8 Position; Gender: Male; Max Current Rating: 12.5A; Connector Type: Micro-Fit+; Pins: 8; Mounting Technology: Through Hole
JP26 JP27 = CMP-009-00341-2: as JP25 on sheet LED_low_side_control; Pins: 2; Case/Package: 0603; RoHS Compliant: Yes; Max Operating Temperature: 155°C; Min Operating Temperature: -55°C; Mounting Technology: Surface Mount
PTH5 = CMP-00028-00043-3
R75 = CMP-009-00306-2: as R30 on sheet LED_low_side_control; Max Operating Temperature: 155°C; Case/Package: 0603; Mounting Technology: Surface Mount; Tolerance: 1%; Min Operating Temperature: -55°C; RoHS Compliant: Yes; Pins: 2; JLCPN: C98220
R76 R77 = CMP-009-00204-3: as R31 on sheet LED_low_side_control; Mounting Technology: Surface Mount; Pins: 2; Case/Package: 0603; Max Operating Temperature: 155°C; Min Operating Temperature: -55°C; RoHS Compliant: Yes; JLCPN: C100044
U21 = CMP-019-00078-2: as U15 on sheet LED_low_side_control; Case/Package: SOIC; Pins: 8; Clock Frequency: 400kHz; Min Operating Temperature: -40°C; Memory Format: EEPROM; Max Operating Temperature: 85°C; Mounting Technology: Surface Mount; JLCPN: C83836